# EAGLE schematic Promobot revA (EAGLE 6.5.0)

## Sheet 1 of 10: M1 driver with CS
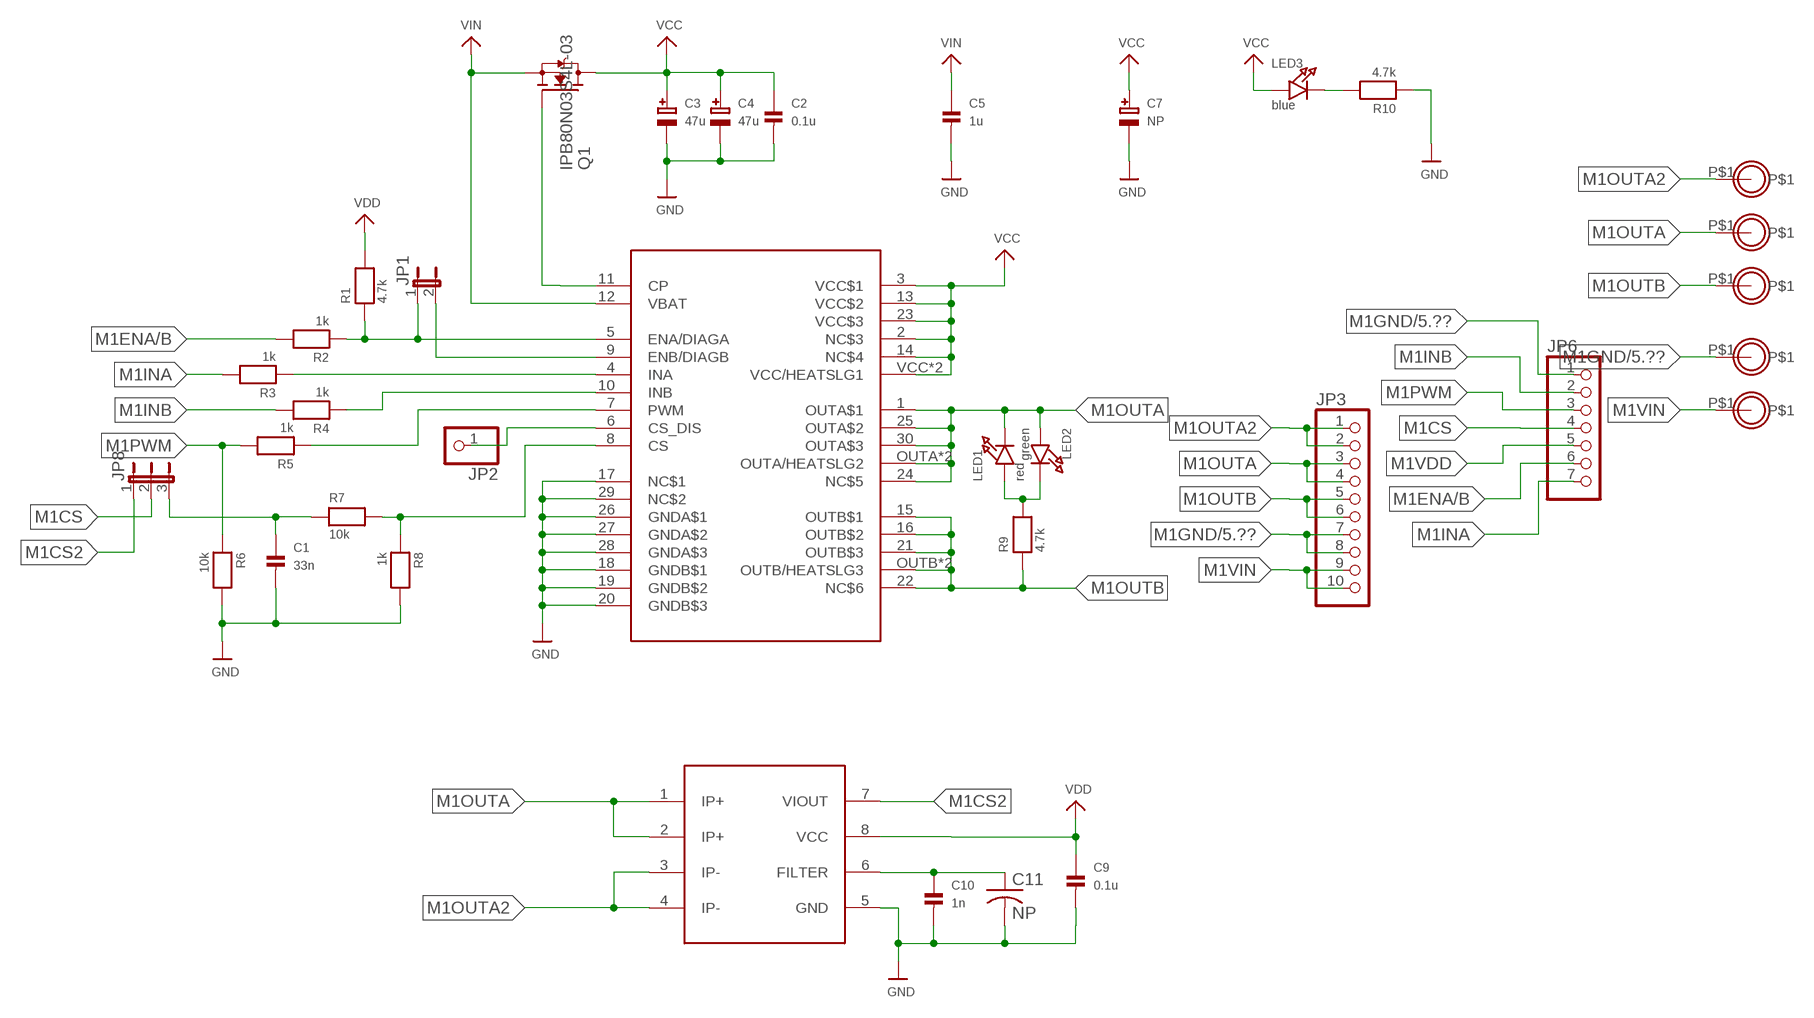
[diagram p0: schematic, sheet 1]

### Parts
C1  33n  CAP_CERAMIC_0603  [_0603]
C2  0.1u  CAP_CERAMIC_0603  [_0603]
C3  47u  CAP_ELECTROLYTICPANASONIC_C  [PANASONIC_C]
C4  47u  CAP_ELECTROLYTICPANASONIC_C  [PANASONIC_C]
C5  1u  CAP_CERAMIC_0805  [_0805]
C7  NP  CAP_ELECTROLYTICPTH_3.5MMGRID_10MMDIA  [CELEC_3.5MM_10MM]
C9  0.1u  CAP_CERAMIC_0603  [_0603]
C10  1n  CAP_CERAMIC_0603  [_0603]
C11  NP  C-US025-024X044  [C025-024X044]
JP1  JUMPER2  [JUMPER2]
JP2  HEADER-1X1ROUND  [1X01_ROUND]
JP3  HEADER-1X10ROUND  [1X10_ROUND]
JP6  HEADER-1X7ROUND  [1X07_ROUND]
JP8  JUMPER3  [JUMPER3]
LED1  red  LED0603  [CHIPLED_0603]
LED2  green  LED0603  [CHIPLED_0603]
LED3  blue  LED0603  [CHIPLED_0603]
M1OUTA  MOUNTINGHOLE2.5_THICK  [MOUNTINGHOLE_2.5_PLATED_THICK]
M1OUTA1  MOUNTINGHOLE2.5_THICK  [MOUNTINGHOLE_2.5_PLATED_THICK]
M1OUTA3  MOUNTINGHOLE2.5_THICK  [MOUNTINGHOLE_2.5_PLATED_THICK]
M1OUTA4  MOUNTINGHOLE2.5_THICK  [MOUNTINGHOLE_2.5_PLATED_THICK]
M1OUTB  MOUNTINGHOLE2.5_THICK  [MOUNTINGHOLE_2.5_PLATED_THICK]
Q1  IPB80N03S4L-03  [TO263]
R1  4.7k  RESISTOR0603  [0603]
R2  1k  RESISTOR0603  [0603]
R3  1k  RESISTOR0603  [0603]
R4  1k  RESISTOR0603  [0603]
R5  1k  RESISTOR0603  [0603]
R6  10k  RESISTOR0603  [0603]
R7  10k  RESISTOR0603  [0603]
R8  1k  RESISTOR0603  [0603]
R9  4.7k  RESISTOR0603  [0603]
R10  4.7k  RESISTOR0603  [0603]
U1  VNH5019A-E  [MULTIPOWERSO-30]
U2  ACS714  [SOIC8_208MIL]

### Nets
M1CS: JP6.4 JP8.2
M1CS1: C1.1 JP8.3 R7.1
M1CS2: JP8.1 U2.7(VIOUT)
M1ENA/B: JP6.6 R2.2
M1GND: C1.2 C2.2 C3.- C4.- C5.2 C7.- C9.2 C10.2 C11.2 JP3.7 JP3.8 JP6.1 M1OUTA3.P$1 R6.2 R8.2 R10.1 U1.17(NC$1) U1.18(GNDB$1) U1.19(GNDB$2) U1.20(GNDB$3) U1.26(GNDA$1) U1.27(GNDA$2) U1.28(GNDA$3) U1.29(NC$2) U2.5(GND) ; supply symbol labelled GND ; also sheet 5
M1INA: JP6.7 R3.2
M1INB: JP6.2 R4.2
M1OUTA: JP3.3 JP3.4 LED1.C LED2.A M1OUTA1.P$1 U1.1(OUTA$1) U1.24(NC$5) U1.25(OUTA$2) U1.30(OUTA$3) U1.OUTA(OUTA/HEATSLG2) U1.OUTA@1(OUTA/HEATSLG2) U2.1(IP+) U2.2(IP+)
M1OUTA2: JP3.1 JP3.2 M1OUTA.P$1 U2.3(IP-) U2.4(IP-)
M1OUTB: JP3.5 JP3.6 M1OUTB.P$1 R9.1 U1.15(OUTB$1) U1.16(OUTB$2) U1.21(OUTB$3) U1.22(NC$6) U1.OUTB(OUTB/HEATSLG3) U1.OUTB@1(OUTB/HEATSLG3)
M1PWM: JP6.3 R5.2 R6.1
M1VCC: C2.1 C3.+ C4.+ C7.+ LED3.A Q1.3(D) U1.2(NC$3) U1.3(VCC$1) U1.13(VCC$2) U1.14(NC$4) U1.23(VCC$3) U1.VCC(VCC/HEATSLG1) U1.VCC@1(VCC/HEATSLG1) ; supply symbol labelled VCC ; also sheet 5
M1VDD: C9.1 JP6.5 R1.2 U2.8(VCC) ; supply symbol labelled VDD
M1VIN: C5.1 JP3.9 JP3.10 M1OUTA4.P$1 Q1.2(S) U1.12(VBAT) ; supply symbol labelled VIN
N$1: Q1.1(G) U1.11(CP)
N$2: JP1.2 U1.9(ENB/DIAGB)
N$3: R5.1 U1.7(PWM)
N$4: JP1.1 R1.1 R2.1 U1.5(ENA/DIAGA)
N$5: R7.2 R8.1 U1.8(CS)
N$6: R3.1 U1.4(INA)
N$7: R4.1 U1.10(INB)
N$8: JP2.1 U1.6(CS_DIS)
N$9: LED3.C R10.2
N$10: C10.1 C11.1 U2.6(FILTER)
N$11: LED1.A LED2.C R9.2

## Sheet 2 of 10: M2 driver with CS
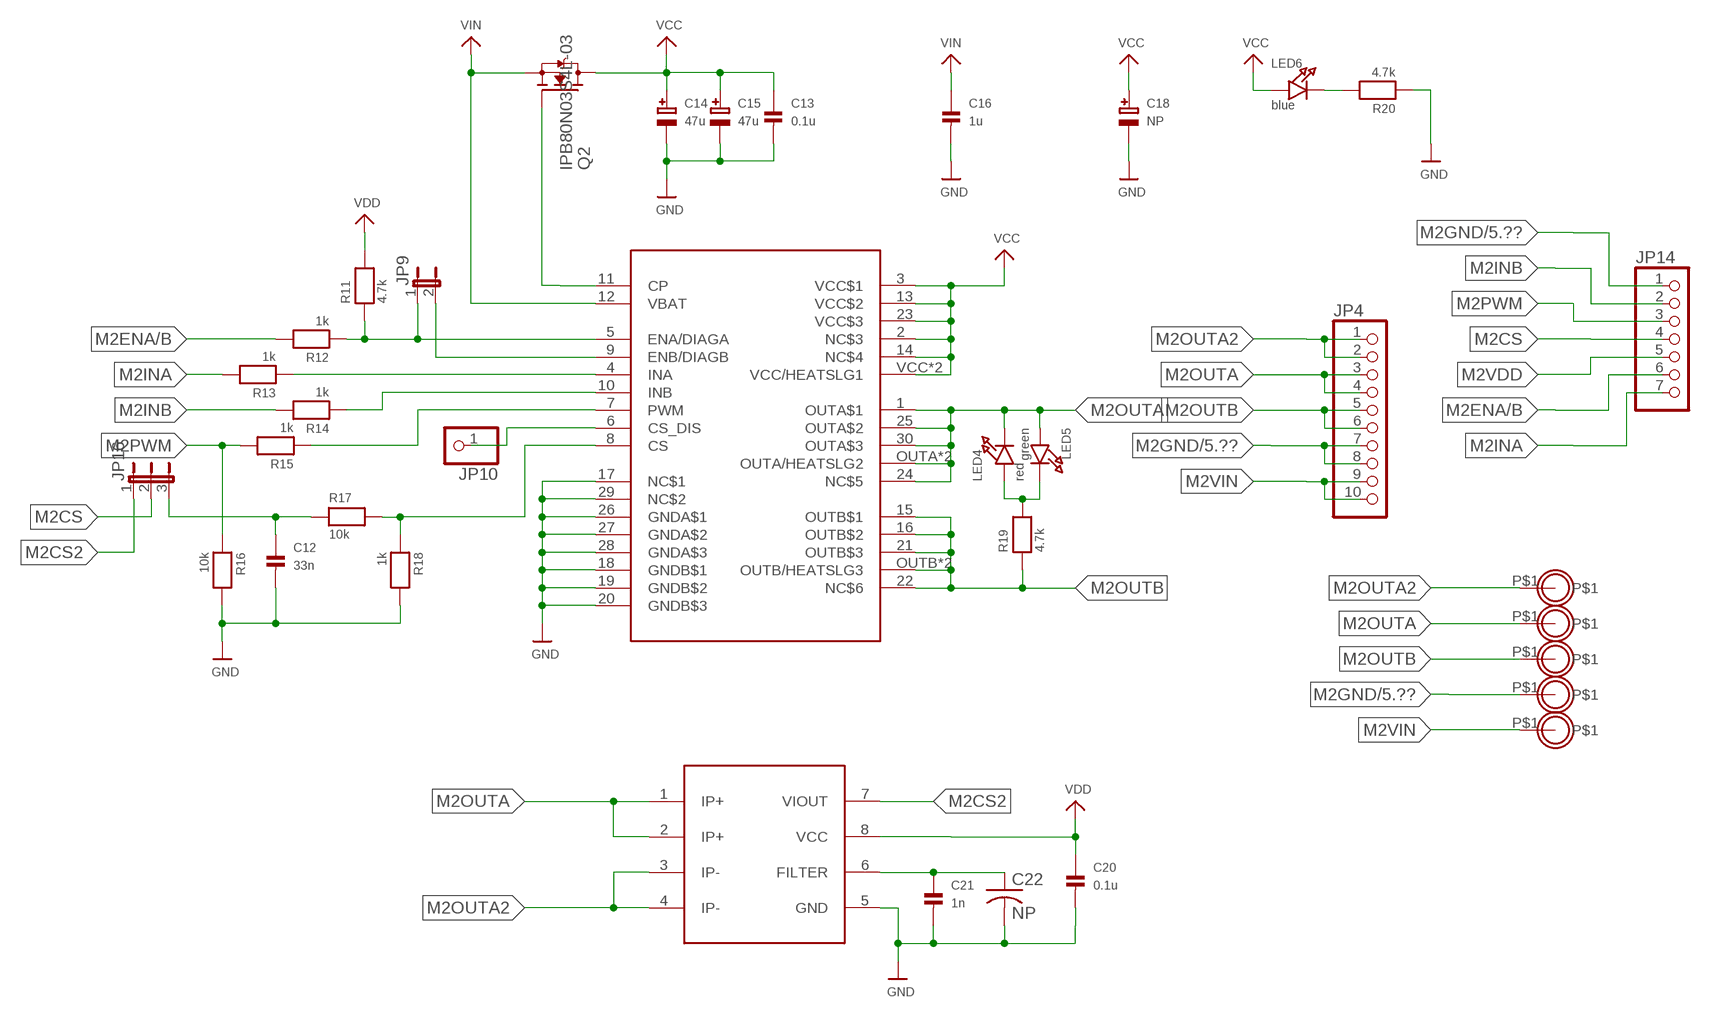
[diagram p1: schematic, sheet 2]

### Parts
C12  33n  CAP_CERAMIC_0603  [_0603]
C13  0.1u  CAP_CERAMIC_0603  [_0603]
C14  47u  CAP_ELECTROLYTICPANASONIC_C  [PANASONIC_C]
C15  47u  CAP_ELECTROLYTICPANASONIC_C  [PANASONIC_C]
C16  1u  CAP_CERAMIC_0805  [_0805]
C18  NP  CAP_ELECTROLYTICPTH_3.5MMGRID_10MMDIA  [CELEC_3.5MM_10MM]
C20  0.1u  CAP_CERAMIC_0603  [_0603]
C21  1n  CAP_CERAMIC_0603  [_0603]
C22  NP  C-US025-024X044  [C025-024X044]
JP4  HEADER-1X10ROUND  [1X10_ROUND]
JP9  JUMPER2  [JUMPER2]
JP10  HEADER-1X1ROUND  [1X01_ROUND]
JP14  HEADER-1X7ROUND  [1X07_ROUND]
JP16  JUMPER3  [JUMPER3]
LED4  red  LED0603  [CHIPLED_0603]
LED5  green  LED0603  [CHIPLED_0603]
LED6  blue  LED0603  [CHIPLED_0603]
M1OUTA2  MOUNTINGHOLE2.5_THICK  [MOUNTINGHOLE_2.5_PLATED_THICK]
M1OUTA5  MOUNTINGHOLE2.5_THICK  [MOUNTINGHOLE_2.5_PLATED_THICK]
M1OUTA6  MOUNTINGHOLE2.5_THICK  [MOUNTINGHOLE_2.5_PLATED_THICK]
M1OUTA7  MOUNTINGHOLE2.5_THICK  [MOUNTINGHOLE_2.5_PLATED_THICK]
M1OUTB1  MOUNTINGHOLE2.5_THICK  [MOUNTINGHOLE_2.5_PLATED_THICK]
Q2  IPB80N03S4L-03  [TO263]
R11  4.7k  RESISTOR0603  [0603]
R12  1k  RESISTOR0603  [0603]
R13  1k  RESISTOR0603  [0603]
R14  1k  RESISTOR0603  [0603]
R15  1k  RESISTOR0603  [0603]
R16  10k  RESISTOR0603  [0603]
R17  10k  RESISTOR0603  [0603]
R18  1k  RESISTOR0603  [0603]
R19  4.7k  RESISTOR0603  [0603]
R20  4.7k  RESISTOR0603  [0603]
U3  VNH5019A-E  [MULTIPOWERSO-30]
U4  ACS714  [SOIC8_208MIL]

### Nets
M2CS: JP14.4 JP16.2
M2CS2: JP16.1 U4.7(VIOUT)
M2ENA/B: JP14.6 R12.2
M2GND: C12.2 C13.2 C14.- C15.- C16.2 C18.- C20.2 C21.2 C22.2 JP4.7 JP4.8 JP14.1 M1OUTA6.P$1 R16.2 R18.2 R20.1 U3.17(NC$1) U3.18(GNDB$1) U3.19(GNDB$2) U3.20(GNDB$3) U3.26(GNDA$1) U3.27(GNDA$2) U3.28(GNDA$3) U3.29(NC$2) U4.5(GND) ; supply symbol labelled GND ; also sheet 5
M2INA: JP14.7 R13.2
M2INB: JP14.2 R14.2
M2OUTA: JP4.3 JP4.4 LED4.C LED5.A M1OUTA5.P$1 U3.1(OUTA$1) U3.24(NC$5) U3.25(OUTA$2) U3.30(OUTA$3) U3.OUTA(OUTA/HEATSLG2) U3.OUTA@1(OUTA/HEATSLG2) U4.1(IP+) U4.2(IP+)
M2OUTA2: JP4.1 JP4.2 M1OUTA2.P$1 U4.3(IP-) U4.4(IP-)
M2OUTB: JP4.5 JP4.6 M1OUTB1.P$1 R19.1 U3.15(OUTB$1) U3.16(OUTB$2) U3.21(OUTB$3) U3.22(NC$6) U3.OUTB(OUTB/HEATSLG3) U3.OUTB@1(OUTB/HEATSLG3)
M2PWM: JP14.3 R15.2 R16.1
M2VCC: C13.1 C14.+ C15.+ C18.+ LED6.A Q2.3(D) U3.2(NC$3) U3.3(VCC$1) U3.13(VCC$2) U3.14(NC$4) U3.23(VCC$3) U3.VCC(VCC/HEATSLG1) U3.VCC@1(VCC/HEATSLG1) ; supply symbol labelled VCC ; also sheet 5
M2VDD: C20.1 JP14.5 R11.2 U4.8(VCC) ; supply symbol labelled VDD
M2VIN: C16.1 JP4.9 JP4.10 M1OUTA7.P$1 Q2.2(S) U3.12(VBAT) ; supply symbol labelled VIN
N$13: Q2.1(G) U3.11(CP)
N$14: JP9.1 R11.1 R12.1 U3.5(ENA/DIAGA)
N$15: JP9.2 U3.9(ENB/DIAGB)
N$16: R13.1 U3.4(INA)
N$17: R14.1 U3.10(INB)
N$18: R15.1 U3.7(PWM)
N$19: R17.2 R18.1 U3.8(CS)
N$20: JP10.1 U3.6(CS_DIS)
N$21: LED4.A LED5.C R19.2
N$22: LED6.C R20.2
N$23: C21.1 C22.1 U4.6(FILTER)
N$24: C12.1 JP16.3 R17.1

## Sheet 3 of 10: M3 driver with CS
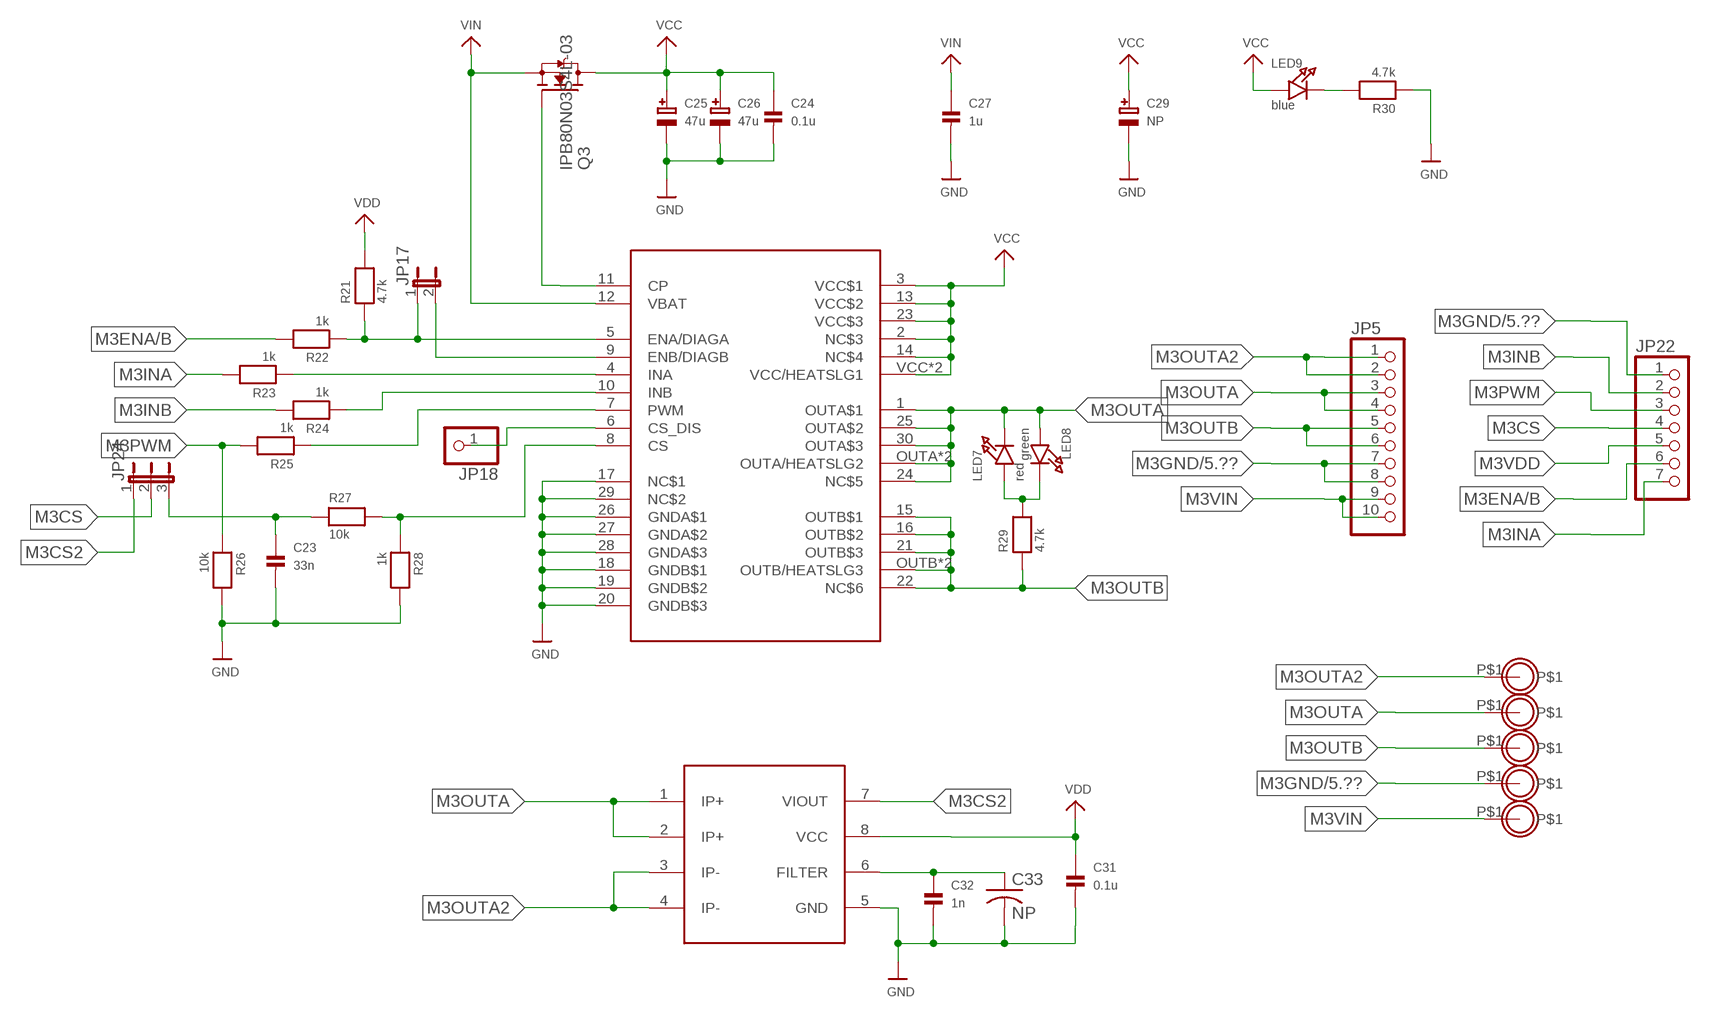
[diagram p2: schematic, sheet 3]

### Parts
C23  33n  CAP_CERAMIC_0603  [_0603]
C24  0.1u  CAP_CERAMIC_0603  [_0603]
C25  47u  CAP_ELECTROLYTICPANASONIC_C  [PANASONIC_C]
C26  47u  CAP_ELECTROLYTICPANASONIC_C  [PANASONIC_C]
C27  1u  CAP_CERAMIC_0805  [_0805]
C29  NP  CAP_ELECTROLYTICPTH_3.5MMGRID_10MMDIA  [CELEC_3.5MM_10MM]
C31  0.1u  CAP_CERAMIC_0603  [_0603]
C32  1n  CAP_CERAMIC_0603  [_0603]
C33  NP  C-US025-024X044  [C025-024X044]
JP5  HEADER-1X10ROUND  [1X10_ROUND]
JP17  JUMPER2  [JUMPER2]
JP18  HEADER-1X1ROUND  [1X01_ROUND]
JP22  HEADER-1X7ROUND  [1X07_ROUND]
JP24  JUMPER3  [JUMPER3]
LED7  red  LED0603  [CHIPLED_0603]
LED8  green  LED0603  [CHIPLED_0603]
LED9  blue  LED0603  [CHIPLED_0603]
M1OUTA8  MOUNTINGHOLE2.5_THICK  [MOUNTINGHOLE_2.5_PLATED_THICK]
M1OUTA9  MOUNTINGHOLE2.5_THICK  [MOUNTINGHOLE_2.5_PLATED_THICK]
M1OUTA10  MOUNTINGHOLE2.5_THICK  [MOUNTINGHOLE_2.5_PLATED_THICK]
M1OUTA11  MOUNTINGHOLE2.5_THICK  [MOUNTINGHOLE_2.5_PLATED_THICK]
M1OUTB2  MOUNTINGHOLE2.5_THICK  [MOUNTINGHOLE_2.5_PLATED_THICK]
Q3  IPB80N03S4L-03  [TO263]
R21  4.7k  RESISTOR0603  [0603]
R22  1k  RESISTOR0603  [0603]
R23  1k  RESISTOR0603  [0603]
R24  1k  RESISTOR0603  [0603]
R25  1k  RESISTOR0603  [0603]
R26  10k  RESISTOR0603  [0603]
R27  10k  RESISTOR0603  [0603]
R28  1k  RESISTOR0603  [0603]
R29  4.7k  RESISTOR0603  [0603]
R30  4.7k  RESISTOR0603  [0603]
U5  VNH5019A-E  [MULTIPOWERSO-30]
U6  ACS714  [SOIC8_208MIL]

### Nets
M3CS: JP22.4 JP24.2
M3CS2: JP24.1 U6.7(VIOUT)
M3ENA/B: JP22.6 R22.2
M3GND: C23.2 C24.2 C25.- C26.- C27.2 C29.- C31.2 C32.2 C33.2 JP5.7 JP5.8 JP22.1 M1OUTA10.P$1 R26.2 R28.2 R30.1 U5.17(NC$1) U5.18(GNDB$1) U5.19(GNDB$2) U5.20(GNDB$3) U5.26(GNDA$1) U5.27(GNDA$2) U5.28(GNDA$3) U5.29(NC$2) U6.5(GND) ; supply symbol labelled GND ; also sheet 5
M3INA: JP22.7 R23.2
M3INB: JP22.2 R24.2
M3OUTA: JP5.3 JP5.4 LED7.C LED8.A M1OUTA9.P$1 U5.1(OUTA$1) U5.24(NC$5) U5.25(OUTA$2) U5.30(OUTA$3) U5.OUTA(OUTA/HEATSLG2) U5.OUTA@1(OUTA/HEATSLG2) U6.1(IP+) U6.2(IP+)
M3OUTA2: JP5.1 JP5.2 M1OUTA8.P$1 U6.3(IP-) U6.4(IP-)
M3OUTB: JP5.5 JP5.6 M1OUTB2.P$1 R29.1 U5.15(OUTB$1) U5.16(OUTB$2) U5.21(OUTB$3) U5.22(NC$6) U5.OUTB(OUTB/HEATSLG3) U5.OUTB@1(OUTB/HEATSLG3)
M3PWM: JP22.3 R25.2 R26.1
M3VCC: C24.1 C25.+ C26.+ C29.+ LED9.A Q3.3(D) U5.2(NC$3) U5.3(VCC$1) U5.13(VCC$2) U5.14(NC$4) U5.23(VCC$3) U5.VCC(VCC/HEATSLG1) U5.VCC@1(VCC/HEATSLG1) ; supply symbol labelled VCC ; also sheet 5
M3VDD: C31.1 JP22.5 R21.2 U6.8(VCC) ; supply symbol labelled VDD
M3VIN: C27.1 JP5.9 JP5.10 M1OUTA11.P$1 Q3.2(S) U5.12(VBAT) ; supply symbol labelled VIN
N$25: Q3.1(G) U5.11(CP)
N$26: JP17.1 R21.1 R22.1 U5.5(ENA/DIAGA)
N$27: JP17.2 U5.9(ENB/DIAGB)
N$28: R23.1 U5.4(INA)
N$29: R24.1 U5.10(INB)
N$30: R25.1 U5.7(PWM)
N$31: R27.2 R28.1 U5.8(CS)
N$32: JP18.1 U5.6(CS_DIS)
N$33: LED7.A LED8.C R29.2
N$34: LED9.C R30.2
N$35: C32.1 C33.1 U6.6(FILTER)
N$48: C23.1 JP24.3 R27.1

## Sheet 4 of 10: M4 driver with CS
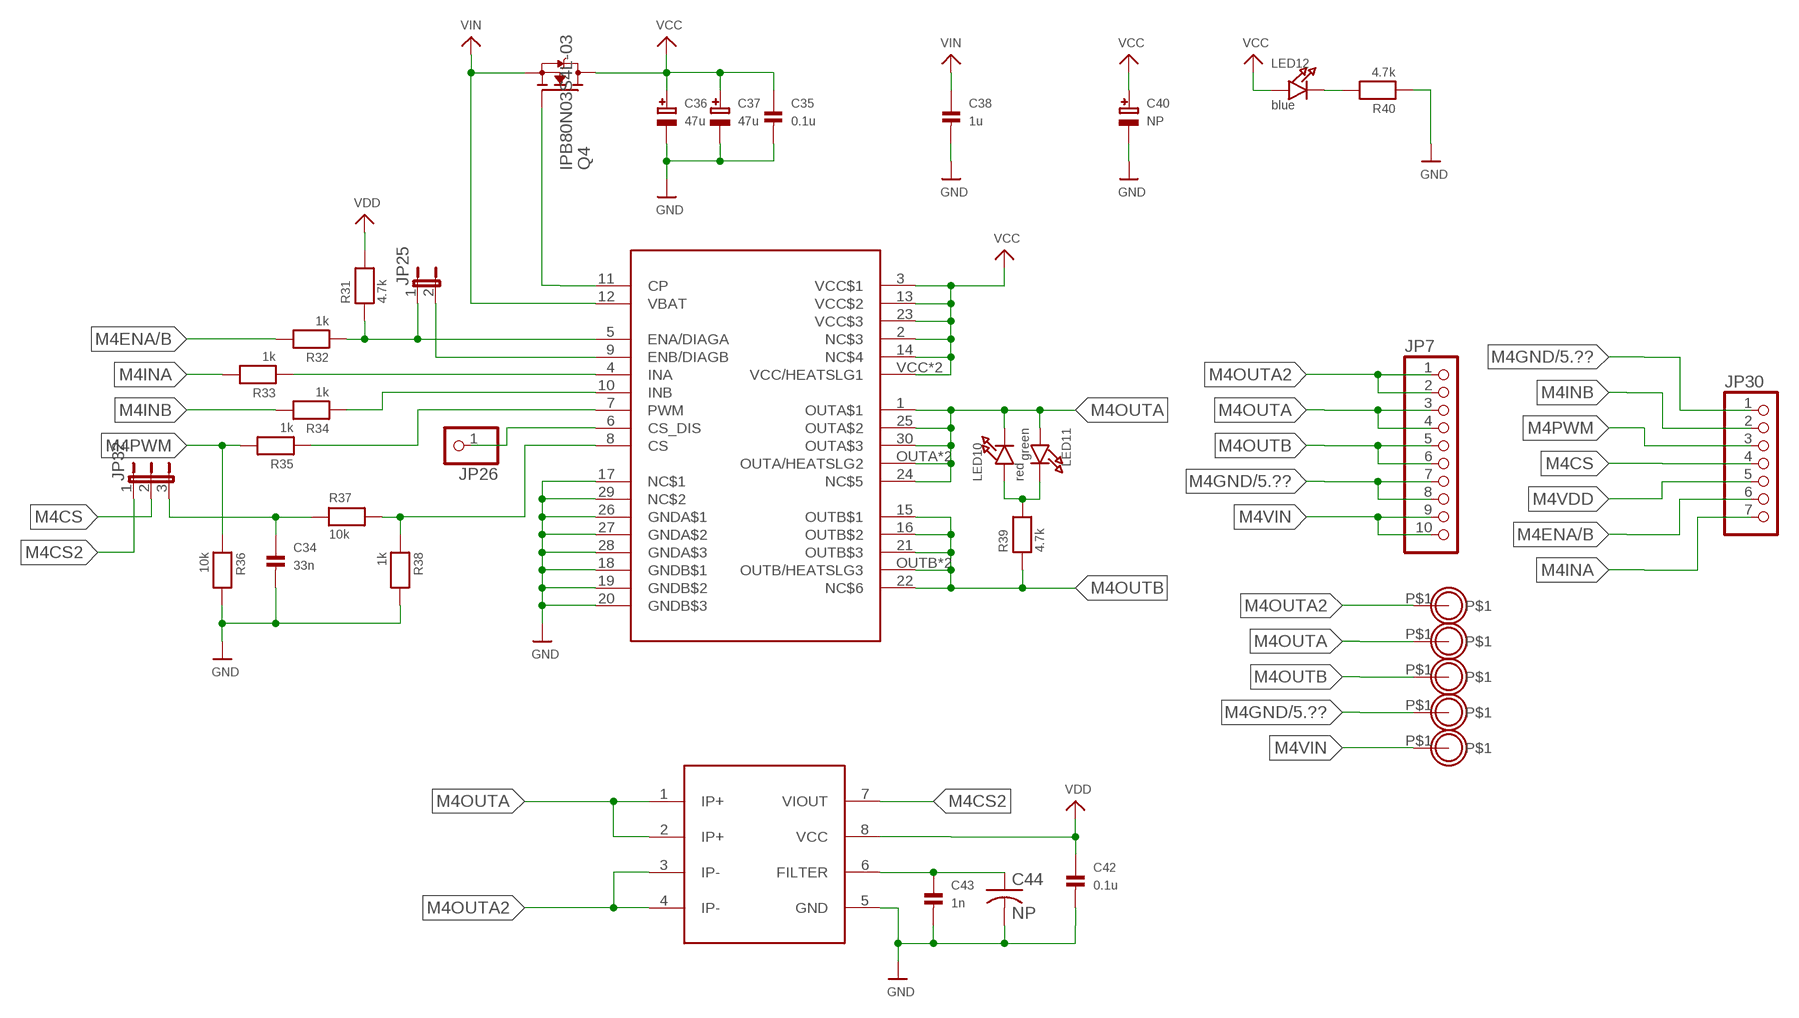
[diagram p3: schematic, sheet 4]

### Parts
C34  33n  CAP_CERAMIC_0603  [_0603]
C35  0.1u  CAP_CERAMIC_0603  [_0603]
C36  47u  CAP_ELECTROLYTICPANASONIC_C  [PANASONIC_C]
C37  47u  CAP_ELECTROLYTICPANASONIC_C  [PANASONIC_C]
C38  1u  CAP_CERAMIC_0805  [_0805]
C40  NP  CAP_ELECTROLYTICPTH_3.5MMGRID_10MMDIA  [CELEC_3.5MM_10MM]
C42  0.1u  CAP_CERAMIC_0603  [_0603]
C43  1n  CAP_CERAMIC_0603  [_0603]
C44  NP  C-US025-024X044  [C025-024X044]
JP7  HEADER-1X10ROUND  [1X10_ROUND]
JP25  JUMPER2  [JUMPER2]
JP26  HEADER-1X1ROUND  [1X01_ROUND]
JP30  HEADER-1X7ROUND  [1X07_ROUND]
JP32  JUMPER3  [JUMPER3]
LED10  red  LED0603  [CHIPLED_0603]
LED11  green  LED0603  [CHIPLED_0603]
LED12  blue  LED0603  [CHIPLED_0603]
M1OUTA12  MOUNTINGHOLE2.5_THICK  [MOUNTINGHOLE_2.5_PLATED_THICK]
M1OUTA13  MOUNTINGHOLE2.5_THICK  [MOUNTINGHOLE_2.5_PLATED_THICK]
M1OUTA14  MOUNTINGHOLE2.5_THICK  [MOUNTINGHOLE_2.5_PLATED_THICK]
M1OUTA15  MOUNTINGHOLE2.5_THICK  [MOUNTINGHOLE_2.5_PLATED_THICK]
M1OUTB3  MOUNTINGHOLE2.5_THICK  [MOUNTINGHOLE_2.5_PLATED_THICK]
Q4  IPB80N03S4L-03  [TO263]
R31  4.7k  RESISTOR0603  [0603]
R32  1k  RESISTOR0603  [0603]
R33  1k  RESISTOR0603  [0603]
R34  1k  RESISTOR0603  [0603]
R35  1k  RESISTOR0603  [0603]
R36  10k  RESISTOR0603  [0603]
R37  10k  RESISTOR0603  [0603]
R38  1k  RESISTOR0603  [0603]
R39  4.7k  RESISTOR0603  [0603]
R40  4.7k  RESISTOR0603  [0603]
U7  VNH5019A-E  [MULTIPOWERSO-30]
U8  ACS714  [SOIC8_208MIL]

### Nets
M4CS: JP30.4 JP32.2
M4CS2: JP32.1 U8.7(VIOUT)
M4ENA/B: JP30.6 R32.2
M4GND: C34.2 C35.2 C36.- C37.- C38.2 C40.- C42.2 C43.2 C44.2 JP7.7 JP7.8 JP30.1 M1OUTA14.P$1 R36.2 R38.2 R40.1 U7.17(NC$1) U7.18(GNDB$1) U7.19(GNDB$2) U7.20(GNDB$3) U7.26(GNDA$1) U7.27(GNDA$2) U7.28(GNDA$3) U7.29(NC$2) U8.5(GND) ; supply symbol labelled GND ; also sheet 5
M4INA: JP30.7 R33.2
M4INB: JP30.2 R34.2
M4OUTA: JP7.3 JP7.4 LED10.C LED11.A M1OUTA13.P$1 U7.1(OUTA$1) U7.24(NC$5) U7.25(OUTA$2) U7.30(OUTA$3) U7.OUTA(OUTA/HEATSLG2) U7.OUTA@1(OUTA/HEATSLG2) U8.1(IP+) U8.2(IP+)
M4OUTA2: JP7.1 JP7.2 M1OUTA12.P$1 U8.3(IP-) U8.4(IP-)
M4OUTB: JP7.5 JP7.6 M1OUTB3.P$1 R39.1 U7.15(OUTB$1) U7.16(OUTB$2) U7.21(OUTB$3) U7.22(NC$6) U7.OUTB(OUTB/HEATSLG3) U7.OUTB@1(OUTB/HEATSLG3)
M4PWM: JP30.3 R35.2 R36.1
M4VCC: C35.1 C36.+ C37.+ C40.+ LED12.A Q4.3(D) U7.2(NC$3) U7.3(VCC$1) U7.13(VCC$2) U7.14(NC$4) U7.23(VCC$3) U7.VCC(VCC/HEATSLG1) U7.VCC@1(VCC/HEATSLG1) ; supply symbol labelled VCC ; also sheet 5
M4VDD: C42.1 JP30.5 R31.2 U8.8(VCC) ; supply symbol labelled VDD
M4VIN: C38.1 JP7.9 JP7.10 M1OUTA15.P$1 Q4.2(S) U7.12(VBAT) ; supply symbol labelled VIN
N$37: Q4.1(G) U7.11(CP)
N$38: JP25.1 R31.1 R32.1 U7.5(ENA/DIAGA)
N$39: JP25.2 U7.9(ENB/DIAGB)
N$40: R33.1 U7.4(INA)
N$41: R34.1 U7.10(INB)
N$42: R35.1 U7.7(PWM)
N$43: R37.2 R38.1 U7.8(CS)
N$44: JP26.1 U7.6(CS_DIS)
N$45: LED10.A LED11.C R39.2
N$46: LED12.C R40.2
N$47: C43.1 C44.1 U8.6(FILTER)
N$49: C34.1 JP32.3 R37.1

## Sheet 5 of 10: General
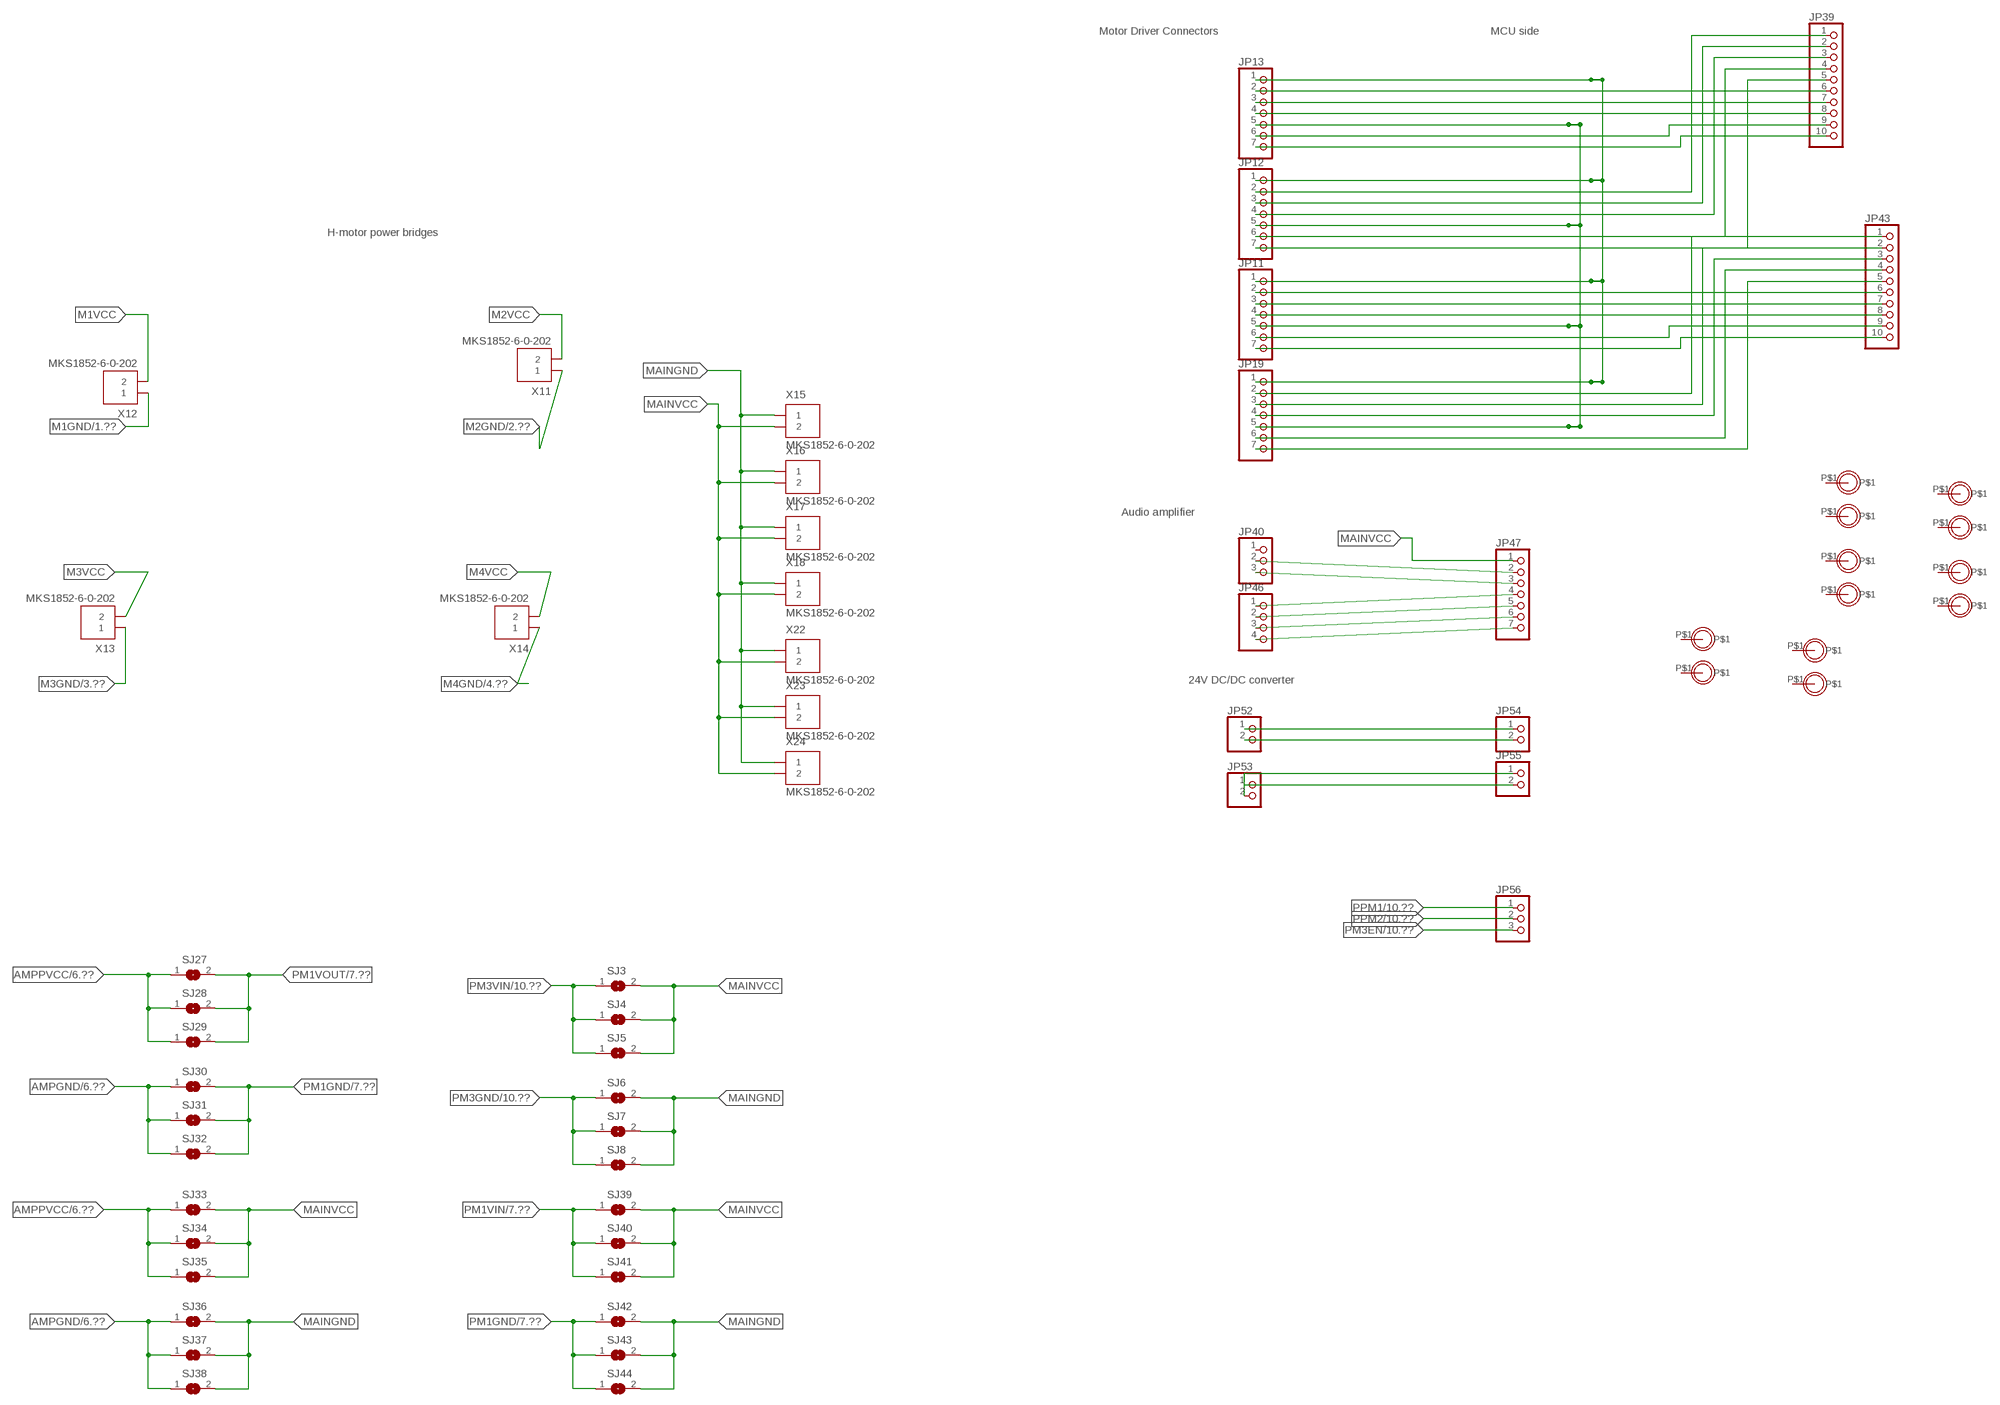
[diagram p4: schematic, sheet 5]

### Parts
JP11  HEADER-1X7ROUND  [1X07_ROUND]
JP12  HEADER-1X7ROUND  [1X07_ROUND]
JP13  HEADER-1X7ROUND  [1X07_ROUND]
JP19  HEADER-1X7ROUND  [1X07_ROUND]
JP39  HEADER-1X1070MIL  [1X10_ROUND70]
JP40  HEADER-1X376MIL  [1X03_ROUND_76]
JP43  HEADER-1X1070MIL  [1X10_ROUND70]
JP46  HEADER-1X476MIL  [1X04_ROUND_76]
JP47  HEADER-1X7ROUND  [1X07_ROUND]
JP52  HEADER-1X2ROUND  [1X02_ROUND]
JP53  HEADER-1X2ROUND  [1X02_ROUND]
JP54  HEADER-1X2ROUND  [1X02_ROUND]
JP55  HEADER-1X2ROUND  [1X02_ROUND]
JP56  HEADER-1X3ROUND  [1X03_ROUND]
M1OUTA16  MOUNTINGHOLE2.5_THICK  [MOUNTINGHOLE_2.5_PLATED_THICK]
M1OUTA17  MOUNTINGHOLE2.5_THICK  [MOUNTINGHOLE_2.5_PLATED_THICK]
M1OUTA18  MOUNTINGHOLE2.5_THICK  [MOUNTINGHOLE_2.5_PLATED_THICK]
M1OUTA19  MOUNTINGHOLE2.5_THICK  [MOUNTINGHOLE_2.5_PLATED_THICK]
M1OUTA20  MOUNTINGHOLE2.5_THICK  [MOUNTINGHOLE_2.5_PLATED_THICK]
M1OUTA21  MOUNTINGHOLE2.5_THICK  [MOUNTINGHOLE_2.5_PLATED_THICK]
M1OUTA22  MOUNTINGHOLE2.5_THICK  [MOUNTINGHOLE_2.5_PLATED_THICK]
M1OUTA23  MOUNTINGHOLE2.5_THICK  [MOUNTINGHOLE_2.5_PLATED_THICK]
M1OUTA24  MOUNTINGHOLE2.5_THICK  [MOUNTINGHOLE_2.5_PLATED_THICK]
M1OUTA25  MOUNTINGHOLE2.5_THICK  [MOUNTINGHOLE_2.5_PLATED_THICK]
M1OUTB4  MOUNTINGHOLE2.5_THICK  [MOUNTINGHOLE_2.5_PLATED_THICK]
M1OUTB5  MOUNTINGHOLE2.5_THICK  [MOUNTINGHOLE_2.5_PLATED_THICK]
SJ3  SOLDERJUMPER  [SOLDERJUMPER_ARROW_NOPASTE]
SJ4  SOLDERJUMPER  [SOLDERJUMPER_ARROW_NOPASTE]
SJ5  SOLDERJUMPER  [SOLDERJUMPER_ARROW_NOPASTE]
SJ6  SOLDERJUMPER  [SOLDERJUMPER_ARROW_NOPASTE]
SJ7  SOLDERJUMPER  [SOLDERJUMPER_ARROW_NOPASTE]
SJ8  SOLDERJUMPER  [SOLDERJUMPER_ARROW_NOPASTE]
SJ27  SOLDERJUMPER  [SOLDERJUMPER_ARROW_NOPASTE]
SJ28  SOLDERJUMPER  [SOLDERJUMPER_ARROW_NOPASTE]
SJ29  SOLDERJUMPER  [SOLDERJUMPER_ARROW_NOPASTE]
SJ30  SOLDERJUMPER  [SOLDERJUMPER_ARROW_NOPASTE]
SJ31  SOLDERJUMPER  [SOLDERJUMPER_ARROW_NOPASTE]
SJ32  SOLDERJUMPER  [SOLDERJUMPER_ARROW_NOPASTE]
SJ33  SOLDERJUMPER  [SOLDERJUMPER_ARROW_NOPASTE]
SJ34  SOLDERJUMPER  [SOLDERJUMPER_ARROW_NOPASTE]
SJ35  SOLDERJUMPER  [SOLDERJUMPER_ARROW_NOPASTE]
SJ36  SOLDERJUMPER  [SOLDERJUMPER_ARROW_NOPASTE]
SJ37  SOLDERJUMPER  [SOLDERJUMPER_ARROW_NOPASTE]
SJ38  SOLDERJUMPER  [SOLDERJUMPER_ARROW_NOPASTE]
SJ39  SOLDERJUMPER  [SOLDERJUMPER_ARROW_NOPASTE]
SJ40  SOLDERJUMPER  [SOLDERJUMPER_ARROW_NOPASTE]
SJ41  SOLDERJUMPER  [SOLDERJUMPER_ARROW_NOPASTE]
SJ42  SOLDERJUMPER  [SOLDERJUMPER_ARROW_NOPASTE]
SJ43  SOLDERJUMPER  [SOLDERJUMPER_ARROW_NOPASTE]
SJ44  SOLDERJUMPER  [SOLDERJUMPER_ARROW_NOPASTE]
X11  MKS1852-6-0-202  [MKS1852-6-0-202]
X12  MKS1852-6-0-202  [MKS1852-6-0-202]
X13  MKS1852-6-0-202  [MKS1852-6-0-202]
X14  MKS1852-6-0-202  [MKS1852-6-0-202]
X15  MKS1852-6-0-202  [MKS1852-6-0-202]
X16  MKS1852-6-0-202  [MKS1852-6-0-202]
X17  MKS1852-6-0-202  [MKS1852-6-0-202]
X18  MKS1852-6-0-202  [MKS1852-6-0-202]
X22  MKS1852-6-0-202  [MKS1852-6-0-202]
X23  MKS1852-6-0-202  [MKS1852-6-0-202]
X24  MKS1852-6-0-202  [MKS1852-6-0-202]

### Nets
AMPGND: SJ30.1 SJ31.1 SJ32.1 SJ36.1 SJ37.1 SJ38.1 ; also sheet 6
AMPPVCC: SJ27.1 SJ28.1 SJ29.1 SJ33.1 SJ34.1 SJ35.1 ; also sheet 6
M1GND: X12.1 ; also sheet 1
M1VCC: X12.2 ; also sheet 1
M2GND: X11.1 ; also sheet 2
M2VCC: X11.2 ; also sheet 2
M3GND: X13.1 ; also sheet 3
M3VCC: X13.2 ; also sheet 3
M4GND: X14.1 ; also sheet 4
M4VCC: X14.2 ; also sheet 4
MAINGND: JP11.1 JP12.1 JP13.1 JP19.1 SJ6.2 SJ7.2 SJ8.2 SJ36.2 SJ37.2 SJ38.2 SJ42.2 SJ43.2 SJ44.2 X15.1 X16.1 X17.1 X18.1 X22.1 X23.1 X24.1
MAINVCC: JP11.5 JP12.5 JP13.5 JP19.5 JP47.1 SJ3.2 SJ4.2 SJ5.2 SJ33.2 SJ34.2 SJ35.2 SJ39.2 SJ40.2 SJ41.2 X15.2 X16.2 X17.2 X18.2 X22.2 X23.2 X24.2
N$84: JP52.1 JP54.1
N$95: JP52.2 JP54.2
N$100: JP13.2 JP39.6
N$108: JP13.3 JP39.7
N$110: JP13.4 JP39.8
N$113: JP40.2 JP47.2
N$114: JP13.6 JP39.9
N$115: JP13.7 JP39.10
N$117: JP12.2 JP39.1
N$122: JP12.3 JP39.2
N$123: JP12.4 JP39.3
N$125: JP12.6 JP39.4
N$126: JP12.7 JP39.5
N$127: JP40.3 JP47.3
N$128: JP11.2 JP43.6
N$129: JP11.3 JP43.7
N$130: JP11.4 JP43.8
N$131: JP46.1 JP47.4
N$132: JP11.6 JP43.9
N$133: JP11.7 JP43.10
N$134: JP46.2 JP47.5
N$135: JP19.2 JP43.1
N$136: JP19.3 JP43.2
N$137: JP19.4 JP43.3
N$138: JP46.3 JP47.6
N$139: JP19.6 JP43.4
N$140: JP19.7 JP43.5
N$141: JP46.4 JP47.7
N$142: JP53.1 JP55.1
N$143: JP53.2 JP55.2
PM1GND: SJ30.2 SJ31.2 SJ32.2 SJ42.1 SJ43.1 SJ44.1 ; also sheet 7
PM1VIN: SJ39.1 SJ40.1 SJ41.1 ; also sheet 7
PM1VOUT: SJ27.2 SJ28.2 SJ29.2 ; also sheet 7
PM3EN: JP56.3 ; also sheet 10
PM3GND: SJ6.1 SJ7.1 SJ8.1 ; also sheet 10
PM3VIN: SJ3.1 SJ4.1 SJ5.1 ; also sheet 10
PPM1: JP56.1 ; also sheet 10
PPM2: JP56.2 ; also sheet 10
Unconnected: JP40.1 M1OUTA16.P$1 M1OUTA17.P$1 M1OUTA18.P$1 M1OUTA19.P$1 M1OUTA20.P$1 M1OUTA21.P$1 M1OUTA22.P$1 M1OUTA23.P$1 M1OUTA24.P$1 M1OUTA25.P$1 M1OUTB4.P$1 M1OUTB5.P$1

### Notes on the sheet
- Motor Driver Connectors | MCU side
- H-motor power bridges
- Audio amplifier
- 24V DC/DC converter

## Sheet 6 of 10: Sound Amplifier
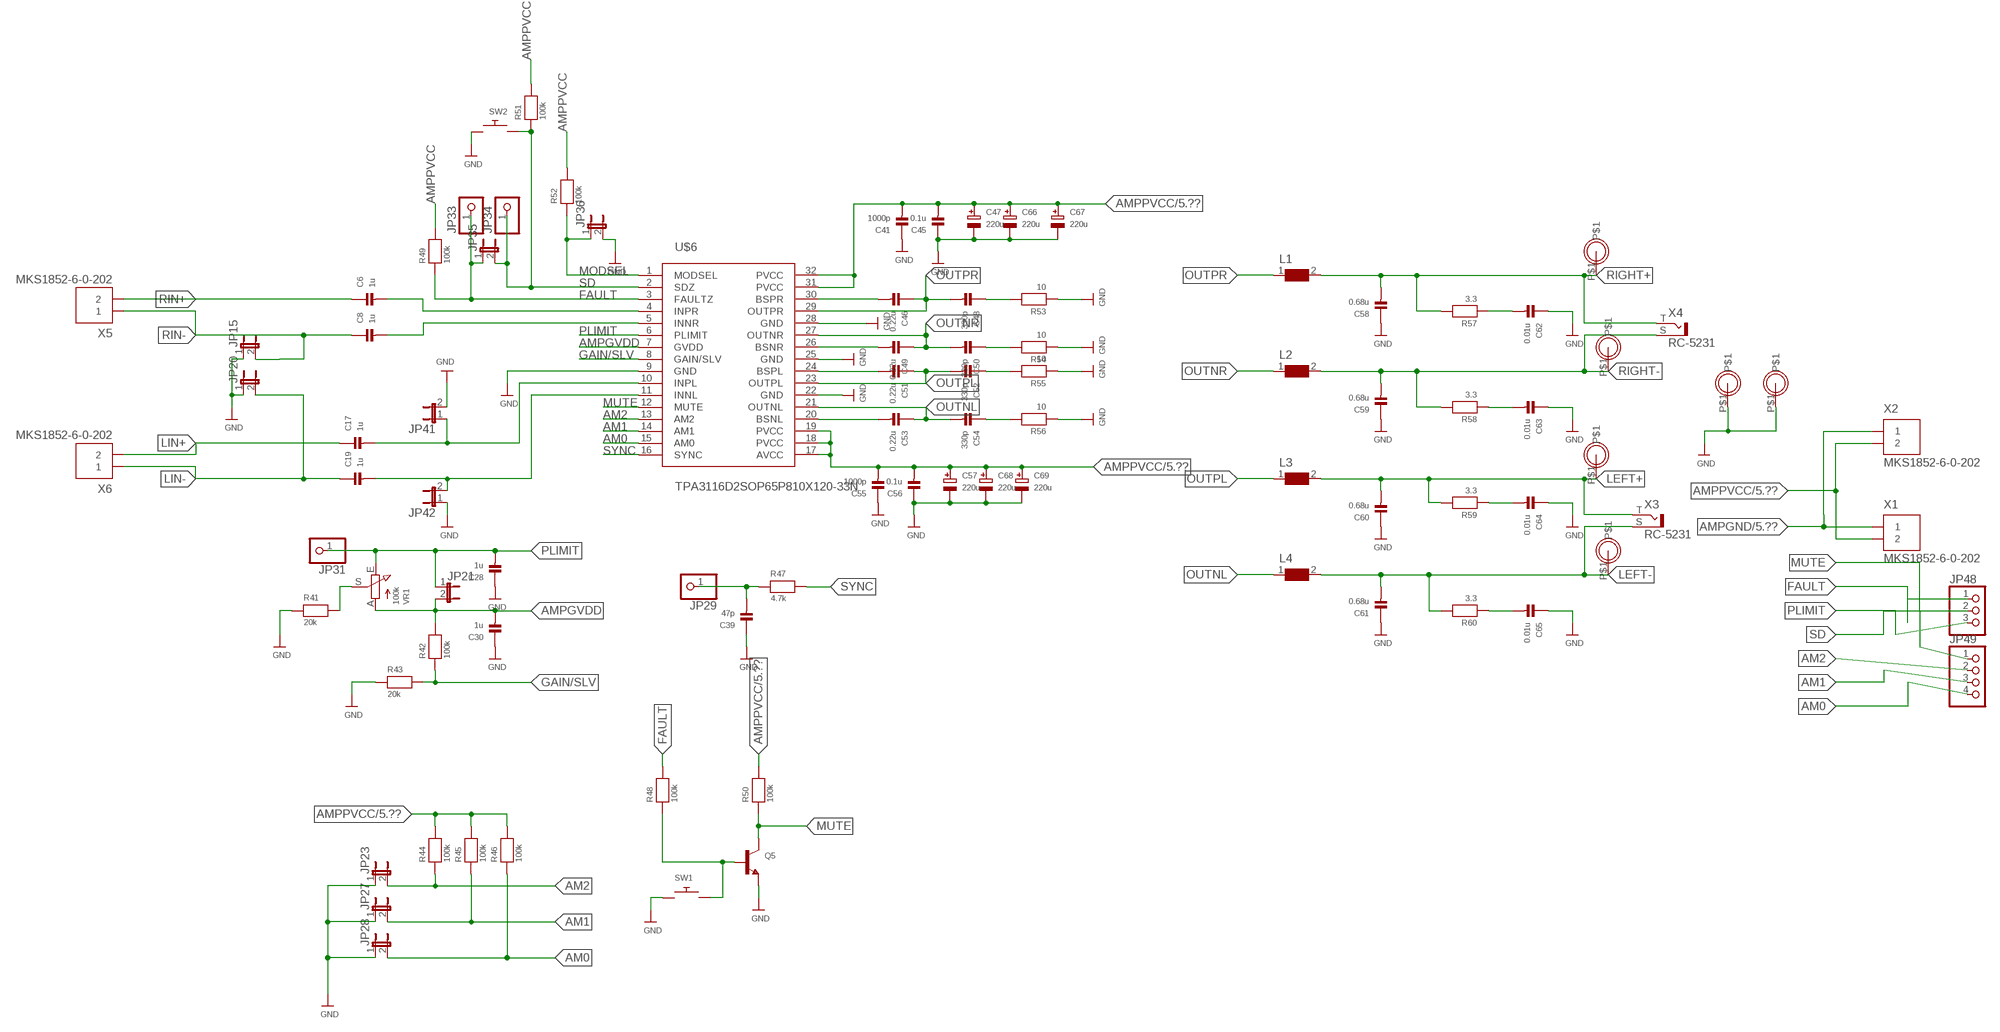
[diagram p5: schematic, sheet 6]

### Parts
C6  1u  CAP_CERAMIC_0603  [_0603]
C8  1u  CAP_CERAMIC_0603  [_0603]
C17  1u  CAP_CERAMIC_0603  [_0603]
C19  1u  CAP_CERAMIC_0603  [_0603]
C28  1u  CAP_CERAMIC_0603MP  [_0603MP]
C30  1u  CAP_CERAMIC_0603MP  [_0603MP]
C39  47p  CAP_CERAMIC_0603  [_0603]
C41  1000p  CAP_CERAMIC_0603  [_0603]
C45  0.1u  CAP_CERAMIC_0603  [_0603]
C46  0.22u  CAP_CERAMIC_0603  [_0603]
C47  220u  CAP_ELECTROLYTICPTH_3.5MMGRID_10MMDIA  [CELEC_3.5MM_10MM]
C48  330p  CAP_CERAMIC_0603  [_0603]
C49  0.22u  CAP_CERAMIC_0603  [_0603]
C50  330p  CAP_CERAMIC_0603  [_0603]
C51  0.22u  CAP_CERAMIC_0603  [_0603]
C52  330p  CAP_CERAMIC_0603  [_0603]
C53  0.22u  CAP_CERAMIC_0603  [_0603]
C54  330p  CAP_CERAMIC_0603  [_0603]
C55  1000p  CAP_CERAMIC_0603  [_0603]
C56  0.1u  CAP_CERAMIC_0603  [_0603]
C57  220u  CAP_ELECTROLYTICPTH_3.5MMGRID_10MMDIA  [CELEC_3.5MM_10MM]
C58  0.68u  CAP_CERAMIC1206  [1206]
C59  0.68u  CAP_CERAMIC1206  [1206]
C60  0.68u  CAP_CERAMIC1206  [1206]
C61  0.68u  CAP_CERAMIC1206  [1206]
C62  0.01u  CAP_CERAMIC_0805  [_0805]
C63  0.01u  CAP_CERAMIC_0805  [_0805]
C64  0.01u  CAP_CERAMIC_0805  [_0805]
C65  0.01u  CAP_CERAMIC_0805  [_0805]
C66  220u  CAP_ELECTROLYTICPTH_3.5MMGRID_10MMDIA  [CELEC_3.5MM_10MM]
C67  220u  CAP_ELECTROLYTICPTH_3.5MMGRID_10MMDIA  [CELEC_3.5MM_10MM]
C68  220u  CAP_ELECTROLYTICPTH_3.5MMGRID_10MMDIA  [CELEC_3.5MM_10MM]
C69  220u  CAP_ELECTROLYTICPTH_3.5MMGRID_10MMDIA  [CELEC_3.5MM_10MM]
JP15  JUMPER2  [JUMPER2]
JP20  JUMPER2  [JUMPER2]
JP21  JUMPER2  [JUMPER2]
JP23  JUMPER2  [JUMPER2]
JP27  JUMPER2  [JUMPER2]
JP28  JUMPER2  [JUMPER2]
JP29  HEADER-1X1ROUND  [1X01_ROUND]
JP31  HEADER-1X1ROUND  [1X01_ROUND]
JP33  HEADER-1X1ROUND  [1X01_ROUND]
JP34  HEADER-1X1ROUND  [1X01_ROUND]
JP35  JUMPER2  [JUMPER2]
JP36  JUMPER2  [JUMPER2]
JP41  JUMPER2  [JUMPER2]
JP42  JUMPER2  [JUMPER2]
JP48  HEADER-1X376MIL  [1X03_ROUND_76]
JP49  HEADER-1X476MIL  [1X04_ROUND_76]
L1  WE-PD-7447709100_1260/1245/1280/1210  [WE-PD_1260/1245/1280/1210]
L2  WE-PD-7447709100_1260/1245/1280/1210  [WE-PD_1260/1245/1280/1210]
L3  WE-PD-7447709100_1260/1245/1280/1210  [WE-PD_1260/1245/1280/1210]
L4  WE-PD-7447709100_1260/1245/1280/1210  [WE-PD_1260/1245/1280/1210]
Q5  TRANSISTOR_NPNWAVE  [SOT23-W]
R41  20k  RESISTOR0603  [0603]
R42  100k  RESISTOR_0805  [_0805]
R43  20k  RESISTOR_0805  [_0805]
R44  100k  RESISTOR0603  [0603]
R45  100k  RESISTOR0603  [0603]
R46  100k  RESISTOR0603  [0603]
R47  4.7k  RESISTOR0603  [0603]
R48  100k  RESISTOR0603  [0603]
R49  100k  RESISTOR0603  [0603]
R50  100k  RESISTOR0603  [0603]
R51  100k  RESISTOR0603  [0603]
R52  100k  RESISTOR0603  [0603]
R53  10  RESISTOR1206  [1206]
R54  10  RESISTOR1206  [1206]
R55  10  RESISTOR1206  [1206]
R56  10  RESISTOR1206  [1206]
R57  3.3  RESISTOR_0603  [_0603]
R58  3.3  RESISTOR_0603  [_0603]
R59  3.3  RESISTOR_0603  [_0603]
R60  3.3  RESISTOR_0603  [_0603]
SW1  SWITCH_PUSHBUTTONSOFTTOUCHSMD_SJ  [PUSHBUTTON_SMD_SJ]
SW2  SWITCH_PUSHBUTTONSOFTTOUCHSMD_SJ  [PUSHBUTTON_SMD_SJ]
U$6  TPA3116D2SOP65P810X120-33N  [SOP65P810X120-33N]
U$81  MOUNTINGHOLE  [MOUNTINGHOLE_3.0_PLATED]
U$82  MOUNTINGHOLE  [MOUNTINGHOLE_3.0_PLATED]
U$83  MOUNTINGHOLE  [MOUNTINGHOLE_3.0_PLATED]
U$84  MOUNTINGHOLE  [MOUNTINGHOLE_3.0_PLATED]
U$89  MOUNTINGHOLE  [MOUNTINGHOLE_3.0_PLATED]
U$90  MOUNTINGHOLE  [MOUNTINGHOLE_3.0_PLATED]
VR1  100k  TRIMPOT10K_BOURNS  [TRIMPOT_BOURNS3MM]
X1  MKS1852-6-0-202  [MKS1852-6-0-202]
X2  MKS1852-6-0-202  [MKS1852-6-0-202]
X3  RC-5231  [RC-5231]
X4  RC-5231  [RC-5231]
X5  MKS1852-6-0-202  [MKS1852-6-0-202]
X6  MKS1852-6-0-202  [MKS1852-6-0-202]

### Nets
AM0: JP28.2 JP49.4 R46.1 U$6.15(AM0)
AM1: JP27.2 JP49.3 R45.1 U$6.14(AM1)
AM2: JP23.2 JP49.2 R44.1 U$6.13(AM2)
AMPGND: C28.1 C30.1 C39.1 C41.1 C45.1 C47.- C55.1 C56.1 C57.- C58.1 C59.1 C60.1 C61.1 C62.1 C63.1 C64.1 C65.1 C66.- C67.- C68.- C69.- JP15.1 JP20.1 JP23.1 JP27.1 JP28.1 JP36.2 JP41.2 JP42.1 Q5.2(E) R41.1 R43.1 R53.1 R54.1 R55.1 R56.1 SW1.P$1 SW2.P$2 U$6.9(GND) U$6.22(GND) U$6.25(GND) U$6.28(GND) U$89.P$1 U$90.P$1 X1.1 X2.1 ; supply symbol labelled GND ; also sheet 5
AMPGVDD: C30.2 JP21.2 R42.2 U$6.7(GVDD) VR1.A
AMPPVCC: C41.2 C45.2 C47.+ C55.2 C56.2 C57.+ C66.+ C67.+ C68.+ C69.+ R44.2 R45.2 R46.2 R49.2 R50.2 R51.2 R52.2 U$6.17(AVCC) U$6.18(PVCC) U$6.19(PVCC) U$6.31(PVCC) U$6.32(PVCC) X1.2 X2.2 ; also sheet 5
FAULT: JP33.1 JP35.1 JP48.1 R48.2 R49.1 U$6.3(FAULTZ)
GAIN/SLV: R42.1 R43.2 U$6.8(GAIN/SLV)
LEFT+: C60.2 L3.2 R59.2 U$83.P$1 X3.T
LEFT-: C61.2 L4.2 R60.2 U$84.P$1 X3.S
LIN+: C17.1 X6.2
LIN-: C19.1 JP20.2 X6.1
MODSEL: JP36.1 R52.1 U$6.1(MODSEL)
MUTE: JP49.1 Q5.3(C) R50.1 U$6.12(MUTE)
N$12: R41.2 VR1.S
N$36: C39.2 JP29.1 R47.1
N$51: Q5.1(B) R48.1 SW1.P$2
N$53: C6.2 U$6.4(INPR)
N$54: C8.2 U$6.5(INNR)
N$55: C46.2 U$6.30(BSPR)
N$56: C48.1 R53.2
N$57: C17.2 JP41.1 U$6.10(INPL)
N$59: C19.2 JP42.2 U$6.11(INNL)
N$65: C51.2 U$6.24(BSPL)
N$66: C49.2 U$6.26(BSNR)
N$68: C50.1 R54.2
N$69: C65.2 R60.1
N$70: C52.1 R55.2
N$71: C62.2 R57.1
N$72: C53.2 U$6.20(BSNL)
N$73: C63.2 R58.1
N$74: C54.1 R56.2
N$76: C64.2 R59.1
OUTNL: C53.1 C54.2 L4.1 U$6.21(OUTNL)
OUTNR: C49.1 C50.2 L2.1 U$6.27(OUTNR)
OUTPL: C51.1 C52.2 L3.1 U$6.23(OUTPL)
OUTPR: C46.1 C48.2 L1.1 U$6.29(OUTPR)
PLIMIT: C28.2 JP21.1 JP31.1 JP48.3 U$6.6(PLIMIT) VR1.E
RIGHT+: C58.2 L1.2 R57.2 U$81.P$1 X4.T
RIGHT-: C59.2 L2.2 R58.2 U$82.P$1 X4.S
RIN+: C6.1 X5.2
RIN-: C8.1 JP15.2 X5.1
SD: JP34.1 JP35.2 JP48.2 R51.1 SW2.P$1 U$6.2(SDZ)
SYNC: R47.2 U$6.16(SYNC)

## Sheet 7 of 10: 21V DC/DC Step-up Converter
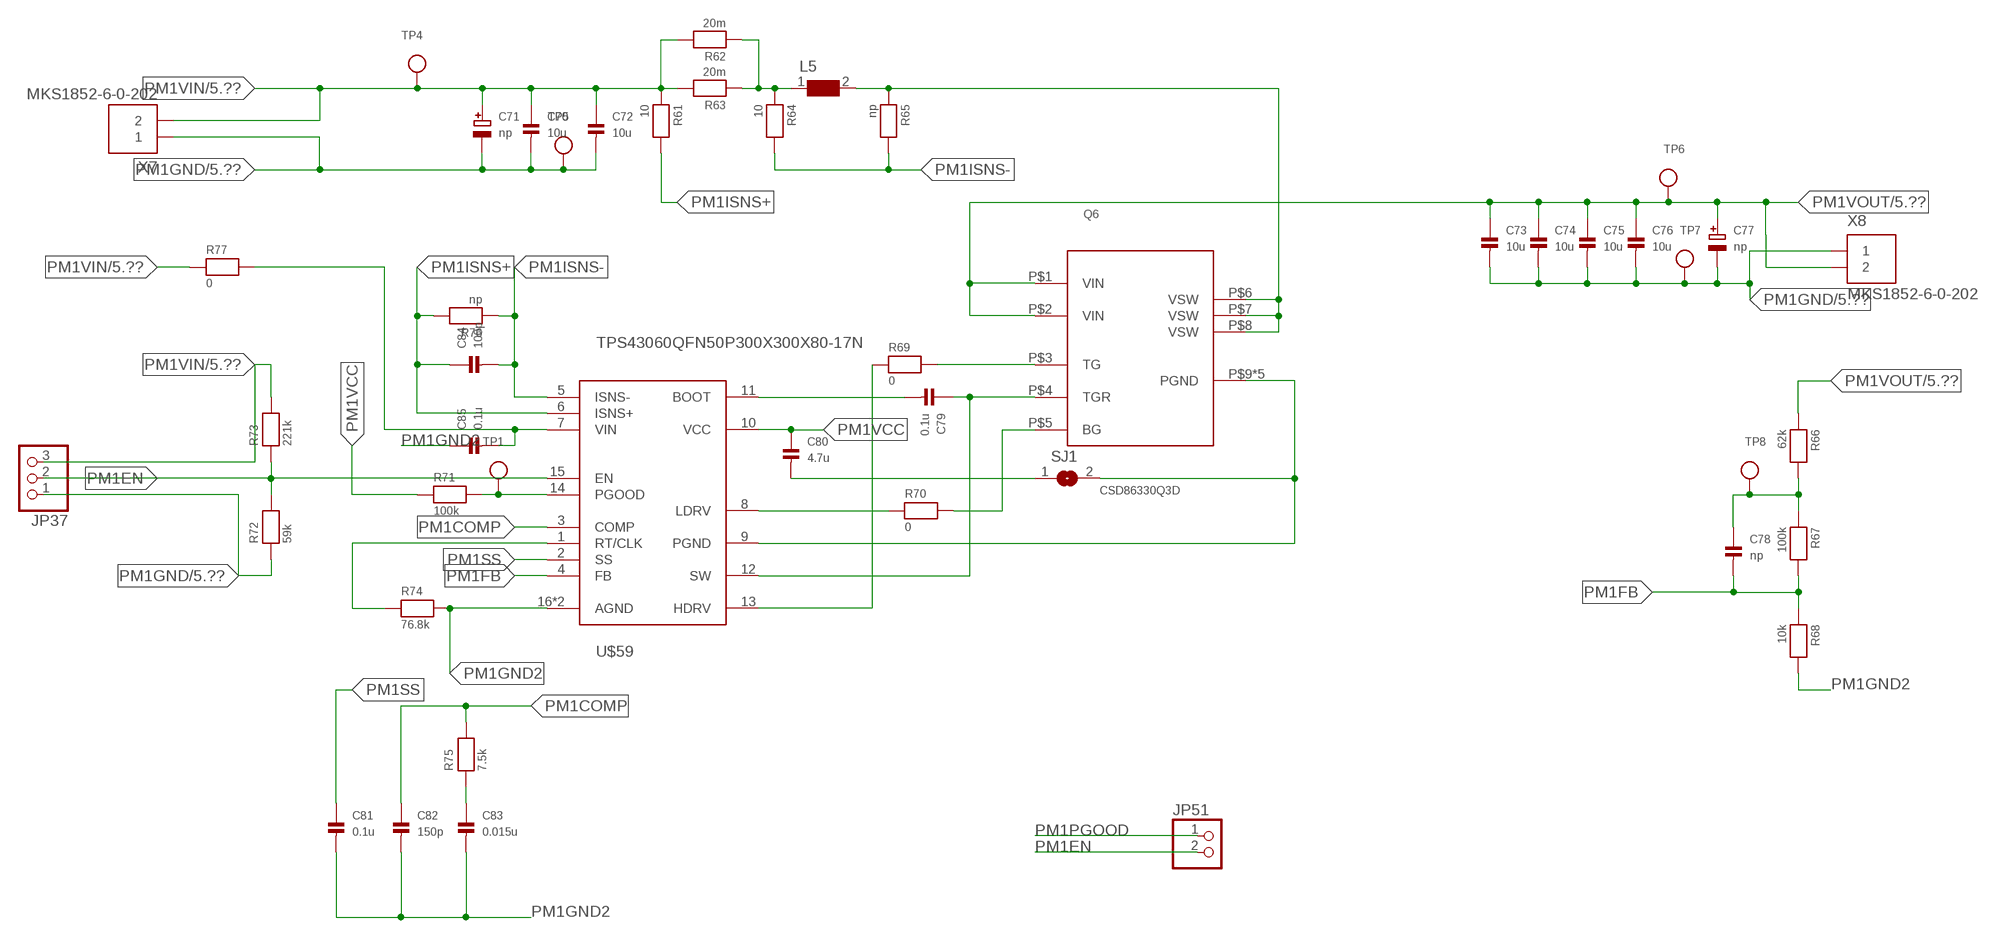
[diagram p6: schematic, sheet 7]

### Parts
C70  10u  CAP_CERAMIC1206  [1206]
C71  np  CAP_ELECTROLYTICPTH_3.5MMGRID_10MMDIA  [CELEC_3.5MM_10MM]
C72  10u  CAP_CERAMIC1206  [1206]
C73  10u  CAP_CERAMIC1206  [1206]
C74  10u  CAP_CERAMIC1206  [1206]
C75  10u  CAP_CERAMIC1206  [1206]
C76  10u  CAP_CERAMIC1206  [1206]
C77  np  CAP_ELECTROLYTICPTH_3.5MMGRID_10MMDIA  [CELEC_3.5MM_10MM]
C78  np  CAP_CERAMIC_0603  [_0603]
C79  0.1u  CAP_CERAMIC_0603  [_0603]
C80  4.7u  CAP_CERAMIC_0603  [_0603]
C81  0.1u  CAP_CERAMIC_0603  [_0603]
C82  150p  CAP_CERAMIC_0603  [_0603]
C83  0.015u  CAP_CERAMIC_0603  [_0603]
C84  100p  CAP_CERAMIC_0603MP  [_0603MP]
C85  0.1u  CAP_CERAMIC_0603MP  [_0603MP]
JP37  HEADER-1X376MIL  [1X03_ROUND_76]
JP51  HEADER-1X2ROUND  [1X02_ROUND]
L5  WE-HCI-744311330_7030/7040/7050  [WE-HCI_7030/7040/7050]
Q6  CSD86330Q3D  [SON330X330]
R61  10  RESISTOR_0603MP  [_0603MP]
R62  20m  RESISTOR1206  [1206]
R63  20m  RESISTOR1206  [1206]
R64  10  RESISTOR_0603MP  [_0603MP]
R65  np  RESISTOR_0603MP  [_0603MP]
R66  62k  RESISTOR0603  [0603]
R67  100k  RESISTOR0603  [0603]
R68  10k  RESISTOR0603  [0603]
R69  0  RESISTOR0603  [0603]
R70  0  RESISTOR0603  [0603]
R71  100k  RESISTOR0603  [0603]
R72  59k  RESISTOR0603  [0603]
R73  221k  RESISTOR0603  [0603]
R74  76.8k  RESISTOR0603  [0603]
R75  7.5k  RESISTOR0603  [0603]
R76  np  RESISTOR_0603MP  [_0603MP]
R77  0  RESISTOR0603  [0603]
SJ1  SOLDERJUMPER  [SOLDERJUMPER_ARROW_NOPASTE]
TP1  TESTPOINT0.1"  [1X01_ROUND]
TP4  TESTPOINT0.1"  [1X01_ROUND]
TP5  TESTPOINT0.1"  [1X01_ROUND]
TP6  TESTPOINT0.1"  [1X01_ROUND]
TP7  TESTPOINT0.1"  [1X01_ROUND]
TP8  TESTPOINT0.1"  [1X01_ROUND]
U$59  TPS43060QFN50P300X300X80-17N  [QFN50P300X300X80-17N]
X7  MKS1852-6-0-202  [MKS1852-6-0-202]
X8  MKS1852-6-0-202  [MKS1852-6-0-202]

### Nets
N$62: L5.1 R62.1 R63.1 R64.1
N$63: L5.2 Q6.P$6(VSW) Q6.P$7(VSW) Q6.P$8(VSW) R65.1
N$67: C78.1 R66.2 R67.1 TP8.1
N$75: Q6.P$3(TG) R69.2
N$77: R69.1 U$59.13(HDRV)
N$78: C79.1 Q6.P$4(TGR) U$59.12(SW)
N$79: C79.2 U$59.11(BOOT)
N$82: R70.1 U$59.8(LDRV)
N$83: Q6.P$5(BG) R70.2
N$87: R74.1 U$59.1(RT/CLK)
N$89: C83.1 R75.1
N$90: C85.2 R77.2 U$59.7(VIN)
PM1COMP: C82.1 R75.2 U$59.3(COMP)
PM1EN: JP37.2 JP51.2 R72.2 R73.1 U$59.15(EN)
PM1FB: C78.2 R67.2 R68.1 U$59.4(FB)
PM1GND: C70.2 C71.- C72.2 C73.2 C74.2 C75.2 C76.2 C77.- JP37.1 Q6.P$9(PGND) Q6.P$10(PGND) Q6.P$11(PGND) Q6.P$12(PGND) Q6.P$13(PGND) R72.1 SJ1.2 TP5.1 TP7.1 U$59.9(PGND) X7.1 X8.1 ; also sheet 5
PM1GND2: C80.2 C81.2 C82.2 C83.2 C85.1 R68.2 R74.2 SJ1.1 U$59.16(AGND) U$59.17(AGND)
PM1ISNS+: C84.1 R61.2 R76.2 U$59.6(ISNS+)
PM1ISNS-: C84.2 R64.2 R65.2 R76.1 U$59.5(ISNS-)
PM1PGOOD: JP51.1 R71.2 TP1.1 U$59.14(PGOOD)
PM1SS: C81.1 U$59.2(SS)
PM1VCC: C80.1 R71.1 U$59.10(VCC)
PM1VIN: C70.1 C71.+ C72.1 JP37.3 R61.1 R62.2 R63.2 R73.2 R77.1 TP4.1 X7.2 ; also sheet 5
PM1VOUT: C73.1 C74.1 C75.1 C76.1 C77.+ Q6.P$1(VIN) Q6.P$2(VIN) R66.1 TP6.1 X8.2 ; also sheet 5

## Sheet 8 of 10: 15V DC/DC Boost Conv
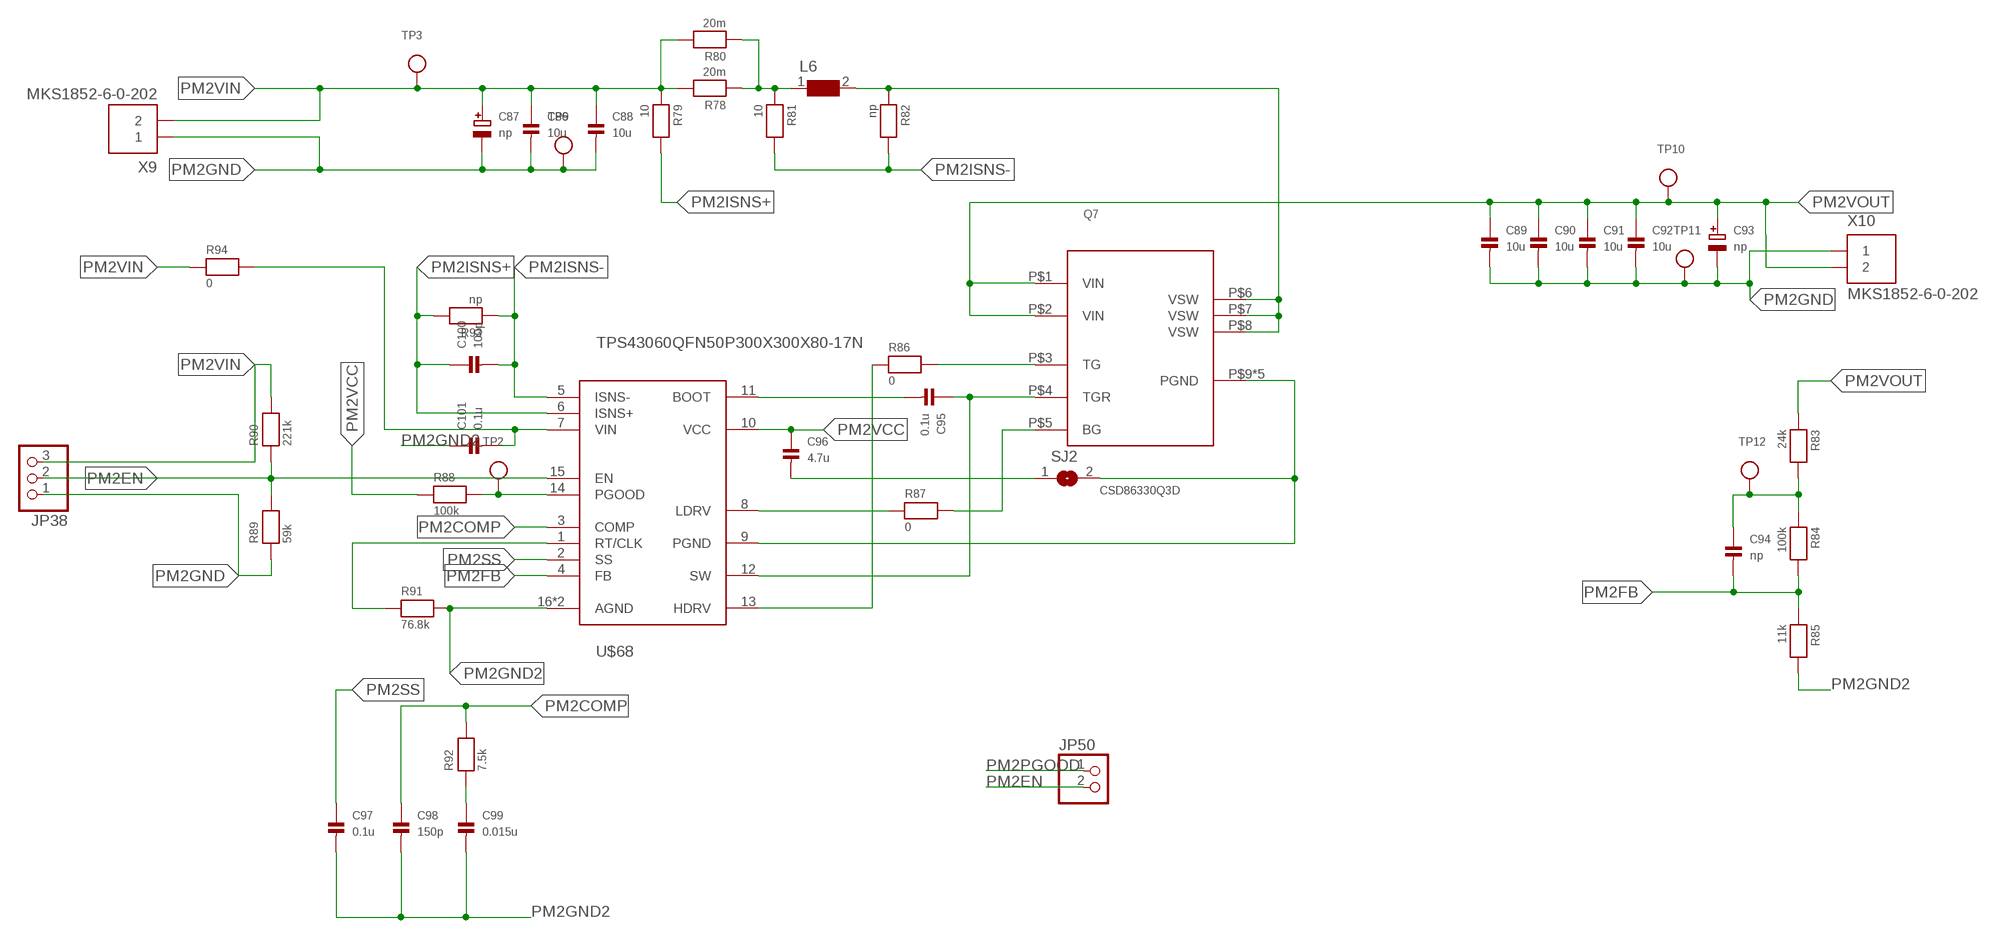
[diagram p7: schematic, sheet 8]

### Parts
C86  10u  CAP_CERAMIC1206  [1206]
C87  np  CAP_ELECTROLYTICPTH_3.5MMGRID_10MMDIA  [CELEC_3.5MM_10MM]
C88  10u  CAP_CERAMIC1206  [1206]
C89  10u  CAP_CERAMIC1206  [1206]
C90  10u  CAP_CERAMIC1206  [1206]
C91  10u  CAP_CERAMIC1206  [1206]
C92  10u  CAP_CERAMIC1206  [1206]
C93  np  CAP_ELECTROLYTICPTH_3.5MMGRID_10MMDIA  [CELEC_3.5MM_10MM]
C94  np  CAP_CERAMIC_0603  [_0603]
C95  0.1u  CAP_CERAMIC_0603  [_0603]
C96  4.7u  CAP_CERAMIC_0603  [_0603]
C97  0.1u  CAP_CERAMIC_0603  [_0603]
C98  150p  CAP_CERAMIC_0603  [_0603]
C99  0.015u  CAP_CERAMIC_0603  [_0603]
C100  100p  CAP_CERAMIC_0603MP  [_0603MP]
C101  0.1u  CAP_CERAMIC_0603MP  [_0603MP]
JP38  HEADER-1X376MIL  [1X03_ROUND_76]
JP50  HEADER-1X2ROUND  [1X02_ROUND]
L6  WE-HCI-744311330_7030/7040/7050  [WE-HCI_7030/7040/7050]
Q7  CSD86330Q3D  [SON330X330]
R78  20m  RESISTOR1206  [1206]
R79  10  RESISTOR_0603MP  [_0603MP]
R80  20m  RESISTOR1206  [1206]
R81  10  RESISTOR_0603MP  [_0603MP]
R82  np  RESISTOR_0603MP  [_0603MP]
R83  24k  RESISTOR0603  [0603]
R84  100k  RESISTOR0603  [0603]
R85  11k  RESISTOR0603  [0603]
R86  0  RESISTOR0603  [0603]
R87  0  RESISTOR0603  [0603]
R88  100k  RESISTOR0603  [0603]
R89  59k  RESISTOR0603  [0603]
R90  221k  RESISTOR0603  [0603]
R91  76.8k  RESISTOR0603  [0603]
R92  7.5k  RESISTOR0603  [0603]
R93  np  RESISTOR_0603MP  [_0603MP]
R94  0  RESISTOR0603  [0603]
SJ2  SOLDERJUMPER  [SOLDERJUMPER_ARROW_NOPASTE]
TP2  TESTPOINT0.1"  [1X01_ROUND]
TP3  TESTPOINT0.1"  [1X01_ROUND]
TP9  TESTPOINT0.1"  [1X01_ROUND]
TP10  TESTPOINT0.1"  [1X01_ROUND]
TP11  TESTPOINT0.1"  [1X01_ROUND]
TP12  TESTPOINT0.1"  [1X01_ROUND]
U$68  TPS43060QFN50P300X300X80-17N  [QFN50P300X300X80-17N]
X9  MKS1852-6-0-202  [MKS1852-6-0-202]
X10  MKS1852-6-0-202  [MKS1852-6-0-202]

### Nets
N$80: L6.1 R78.1 R80.1 R81.1
N$81: L6.2 Q7.P$6(VSW) Q7.P$7(VSW) Q7.P$8(VSW) R82.1
N$85: C94.1 R83.2 R84.1 TP12.1
N$86: Q7.P$3(TG) R86.2
N$88: R86.1 U$68.13(HDRV)
N$91: C95.1 Q7.P$4(TGR) U$68.12(SW)
N$92: C95.2 U$68.11(BOOT)
N$93: R87.1 U$68.8(LDRV)
N$94: Q7.P$5(BG) R87.2
N$96: R91.1 U$68.1(RT/CLK)
N$97: C99.1 R92.1
N$98: C101.2 R94.2 U$68.7(VIN)
PM2COMP: C98.1 R92.2 U$68.3(COMP)
PM2EN: JP38.2 JP50.2 R89.2 R90.1 U$68.15(EN)
PM2FB: C94.2 R84.2 R85.1 U$68.4(FB)
PM2GND: C86.2 C87.- C88.2 C89.2 C90.2 C91.2 C92.2 C93.- JP38.1 Q7.P$9(PGND) Q7.P$10(PGND) Q7.P$11(PGND) Q7.P$12(PGND) Q7.P$13(PGND) R89.1 SJ2.2 TP9.1 TP11.1 U$68.9(PGND) X9.1 X10.1
PM2GND2: C96.2 C97.2 C98.2 C99.2 C101.1 R85.2 R91.2 SJ2.1 U$68.16(AGND) U$68.17(AGND)
PM2ISNS+: C100.1 R79.2 R93.2 U$68.6(ISNS+)
PM2ISNS-: C100.2 R81.2 R82.2 R93.1 U$68.5(ISNS-)
PM2PGOOD: JP50.1 R88.2 TP2.1 U$68.14(PGOOD)
PM2SS: C97.1 U$68.2(SS)
PM2VCC: C96.1 R88.1 U$68.10(VCC)
PM2VIN: C86.1 C87.+ C88.1 JP38.3 R78.2 R79.1 R80.2 R90.2 R94.1 TP3.1 X9.2
PM2VOUT: C89.1 C90.1 C91.1 C92.1 C93.+ Q7.P$1(VIN) Q7.P$2(VIN) R83.1 TP10.1 X10.2

## Sheet 9 of 10: MCU
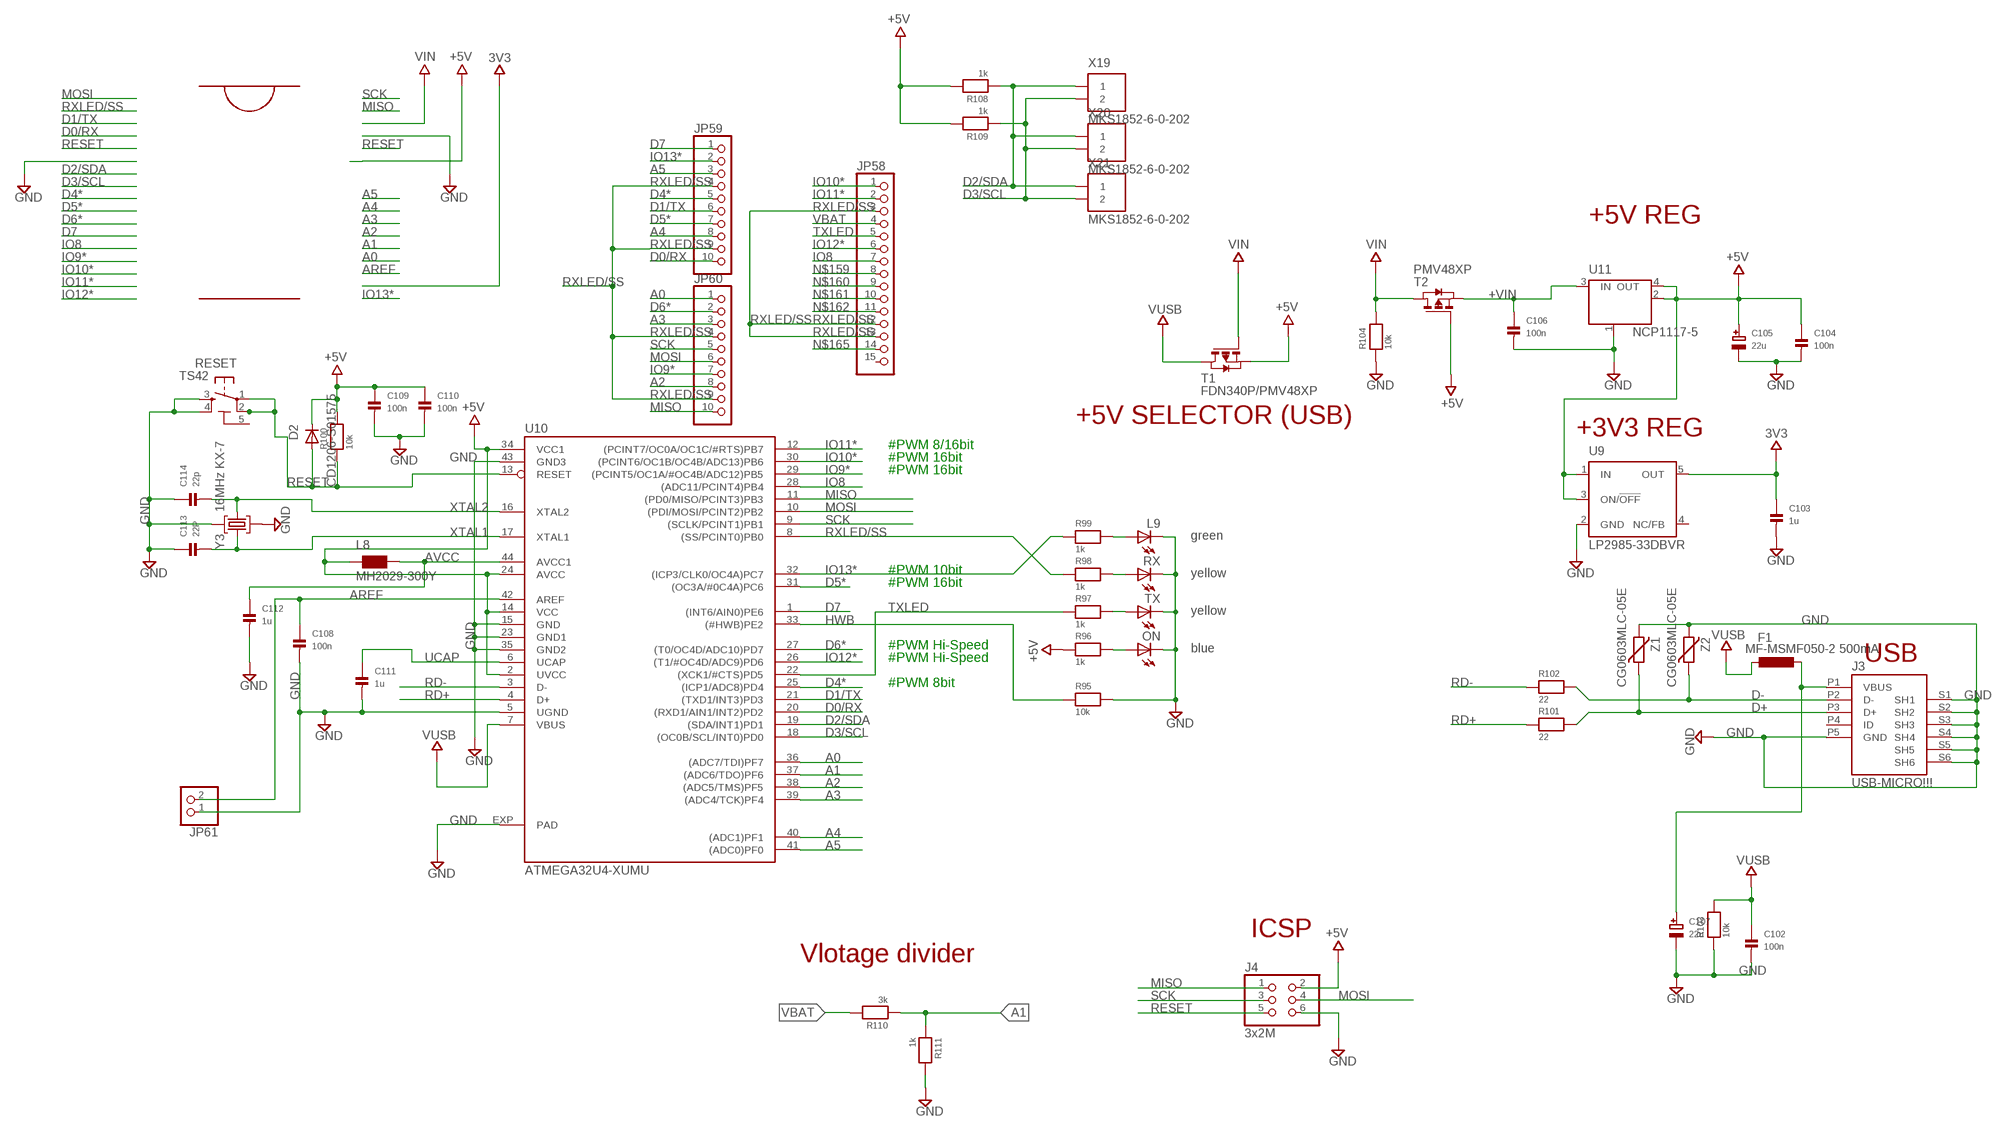
[diagram p8: schematic, sheet 9]

### Parts
C102  100n  CAP_CERAMIC_0603  [_0603]
C103  1u  CAP_CERAMIC_0603  [_0603]
C104  100n  CAP_CERAMIC_0603  [_0603]
C105  22u  CAP_TANTALUMA/3216_REFLOW  [EIA3216-18/A-R]
C106  100n  CAP_CERAMIC_0603  [_0603]
C107  22u  CAP_TANTALUMA/3216_REFLOW  [EIA3216-18/A-R]
C108  100n  CAP_CERAMIC_0603  [_0603]
C109  100n  CAP_CERAMIC_0603  [_0603]
C110  100n  CAP_CERAMIC_0603  [_0603]
C111  1u  CAP_CERAMIC_0603  [_0603]
C112  1u  CAP_CERAMIC_0603  [_0603]
C113  22P  CAP_CERAMIC_0603  [_0603]
C114  22p  CAP_CERAMIC_0603  [_0603]
D2  CD1206-S01575  DIODE-MINIMELF  [MINIMELF]
F1  MF-MSMF050-2 500mA  L-EUL1812  [L1812]
J3  USB-MICRO!!!  MYCON2_USB-MINI-B  [CON2_USB_MICRO_B_AT]
J4  3x2M  PINHD-2X3  [2X03]
JP58  HEADER-1X15  [1X15_ROUND_70]
JP59  HEADER-1X1070MIL  [1X10_ROUND70]
JP60  HEADER-1X1070MIL  [1X10_ROUND70]
JP61  HEADER-1X2ROUND  [1X02_ROUND]
L8  MH2029-300Y  WE-CBF_0805  [0805]
L9  green  LEDCHIPLED_0603  [CHIPLED_0603]
ON  blue  LEDCHIPLED_0603  [CHIPLED_0603]
R95  10k  RESISTOR_0603  [_0603]
R96  1k  RESISTOR_0603  [_0603]
R97  1k  RESISTOR_0603  [_0603]
R98  1k  RESISTOR_0603  [_0603]
R99  1k  RESISTOR_0603  [_0603]
R100  10k  RESISTOR_0603  [_0603]
R101  22  RESISTOR_0603  [_0603]
R102  22  RESISTOR_0603  [_0603]
R103  10k  RESISTOR_0603  [_0603]
R104  10k  RESISTOR_0603  [_0603]
R108  1k  RESISTOR_0603  [_0603]
R109  1k  RESISTOR_0603  [_0603]
R110  3k  RESISTOR_0603MP  [_0603MP]
R111  1k  RESISTOR_0603MP  [_0603MP]
RESET  TS42  [TS42]
RX  yellow  LEDCHIPLED_0603  [CHIPLED_0603]
T1  FDN340P/PMV48XP  PMOSSOT23  [SOT-23]
T2  PMV48XP  PMOSSOT23  [SOT-23]
TX  yellow  LEDCHIPLED_0603  [CHIPLED_0603]
U9  LP2985-33DBVR  LP2985-XXDBVR33  [SOT23-DBV]
U10  ATMEGA32U4-XUMU  [QFN44ML7X7]
U11  NCP1117-5  LINEAR_MC33269ST  [LINEAR_SOT223]
X19  MKS1852-6-0-202  [MKS1852-6-0-202]
X20  MKS1852-6-0-202  [MKS1852-6-0-202]
X21  MKS1852-6-0-202  [MKS1852-6-0-202]
Y3  16MHz KX-7  CRYSTAL-3.2-2.5  [CRYSTAL-3.2-2.5]
Z1  CG0603MLC-05E  VARISTORCN0603  [CT/CN0603]
Z2  CG0603MLC-05E  VARISTORCN0603  [CT/CN0603]

### Nets
3V3: C103.1 U9.5(OUT)
+5V: C104.1 C105.+ C109.1 C110.1 D2.C J4.2 L8.1 R96.1 R100.2 R108.2 R109.2 T1.2(S) T2.3(G) U9.1(IN) U9.3(ON/!OFF) U10.2(UVCC) U10.14(VCC) U10.24(AVCC) U10.34(VCC1) U11.2(OUT) U11.4(OUT)
+VIN: C106.1 T2.2(S) U11.3(IN)
A0: JP60.1 U10.36((ADC7/TDI)PF7)
A1: R110.1 R111.1 U10.37((ADC6/TDO)PF6)
A2: JP60.8 U10.38((ADC5/TMS)PF5)
A3: JP60.3 U10.39((ADC4/TCK)PF4)
A4: JP59.8 U10.40((ADC1)PF1)
A5: JP59.3 U10.41((ADC0)PF0)
AREF: C108.1 JP61.2 U10.42(AREF)
AVCC: C112.1 L8.2 U10.44(AVCC1)
D0/RX: JP59.10 U10.20((RXD1/AIN1/INT2)PD2)
D1/TX: JP59.6 U10.21((TXD1/INT3)PD3)
D2/SDA: R108.1 U10.19((SDA/INT1)PD1) X19.1 X20.1 X21.1
D3/SCL: R109.1 U10.18((OC0B/SCL/INT0)PD0) X19.2 X20.2 X21.2
D4*: JP59.5 U10.25((ICP1/ADC8)PD4)
D5*: JP59.7 U10.31((OC3A/#0C4A)PC6)
D6*: JP60.2 U10.27((T0/OC4D/ADC10)PD7)
D7: JP59.1 U10.1((INT6/AIN0)PE6)
D+: J3.P3(D+) R101.2 Z1.1
D-: J3.P2(D-) R102.2 Z2.1
GND: C102.2 C103.2 C104.2 C105.- C106.2 C107.- C108.2 C109.2 C110.2 C111.2 C112.2 C113.1 C114.1 J3.P5(GND) J3.S1(SH1) J3.S2(SH2) J3.S3(SH3) J3.S4(SH4) J3.S5(SH5) J3.S6(SH6) J4.6 JP61.1 L9.C ON.C R95.2 R103.1 R104.1 R111.2 RESET.3 RESET.4 RX.C TX.C U9.2(GND) U10.5(UGND) U10.15(GND) U10.23(GND1) U10.35(GND2) U10.43(GND3) U10.EXP(PAD) U11.1(GND/ADJ) Y3.2(GND) Y3.4(GND) Z1.2 Z2.2
HWB: R95.1 U10.33((#HWB)PE2)
IO8: JP58.7 U10.28((ADC11/PCINT4)PB4)
IO9*: JP60.7 U10.29((PCINT5/OC1A/#OC4B/ADC12)PB5)
IO10*: JP58.1 U10.30((PCINT6/OC1B/OC4B/ADC13)PB6)
IO11*: JP58.2 U10.12((PCINT7/OC0A/OC1C/#RTS)PB7)
IO12*: JP58.6 U10.26((T1/#OC4D/ADC9)PD6)
IO13*: JP59.2 R99.1 U10.32((ICP3/CLK0/OC4A)PC7)
MISO: J4.1 JP60.10 U10.11((PD0/MISO/PCINT3)PB3)
MOSI: J4.4 JP60.6 U10.10((PDI/MOSI/PCINT2)PB2)
N$118: L9.A R99.2
N$119: R98.2 RX.A
N$120: R97.2 TX.A
N$121: ON.A R96.2
N$159: JP58.8
N$160: JP58.9
N$161: JP58.10
N$162: JP58.11
N$165: JP58.14
RD+: R101.1 U10.4(D+)
RD-: R102.1 U10.3(D-)
RESET: D2.A J4.5 R100.1 RESET.1 RESET.2 U10.13(RESET)
RXLED/SS: JP58.3 JP58.12 JP58.13 JP59.4 JP59.9 JP60.4 JP60.9 R98.1 U10.8((SS/PCINT0)PB0)
SCK: J4.3 JP60.5 U10.9((SCLK/PCINT1)PB1)
TXLED: JP58.5 R97.1 U10.22((XCK1/#CTS)PD5)
UCAP: C111.1 U10.6(UCAP)
VBAT: JP58.4 R110.2
VIN: R104.2 T1.3(G) T2.1(D)
VUSB: C102.1 F1.2 R103.2 T1.1(D) U10.7(VBUS)
VUSBD: C107.+ F1.1 J3.P1(VBUS)
XTAL1: C113.2 U10.17(XTAL1) Y3.3(C2)
XTAL2: C114.2 U10.16(XTAL2) Y3.1(C1)
Unconnected: J3.P4(ID) JP58.15 U9.4(NC/FB)

### Notes on the sheet
- +5V REG
- +5V SELECTOR (USB)
- +3V3 REG
- #PWM 8/16bit
- #PWM 16bit
- #PWM 16bit
- #PWM 10bit
- #PWM 16bit
- #PWM Hi-Speed
- #PWM Hi-Speed | USB
- #PWM 8bit
- ICSP
- Vlotage divider

## Sheet 10 of 10: 5V DC/DC converter
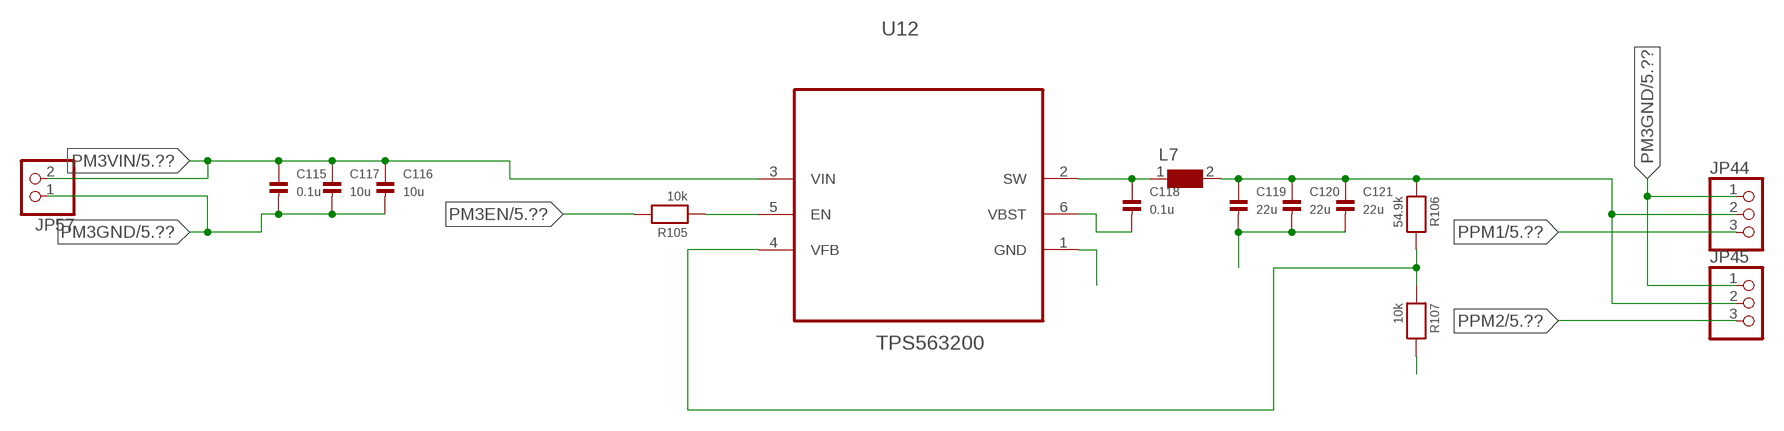
[diagram p9: schematic, sheet 10]

### Parts
C115  0.1u  CAP_CERAMIC_0603  [_0603]
C116  10u  CAP_CERAMIC1206  [1206]
C117  10u  CAP_CERAMIC1206  [1206]
C118  0.1u  CAP_CERAMIC_0603  [_0603]
C119  22u  CAP_CERAMIC1206  [1206]
C120  22u  CAP_CERAMIC1206  [1206]
C121  22u  CAP_CERAMIC1206  [1206]
JP44  HEADER-1X376MIL  [1X03_ROUND_76]
JP45  HEADER-1X376MIL  [1X03_ROUND_76]
JP57  HEADER-1X2ROUND  [1X02_ROUND]
L7  WE-HCI-744311330_7030/7040/7050  [WE-HCI_7030/7040/7050]
R105  10k  RESISTOR_0603  [_0603]
R106  54.9k  RESISTOR_0603  [_0603]
R107  10k  RESISTOR_0603  [_0603]
U12  TPS563200  [SOT95P280X145-6N]

### Nets
N$144: R105.1 U12.5(EN)
N$145: R106.2 R107.1 U12.4(VFB)
N$147: C118.1 L7.1 U12.2(SW)
N$149: C118.2 U12.6(VBST)
PM3EN: R105.2 ; also sheet 5
PM3GND: C115.2 C116.2 C117.2 C119.2 C120.2 C121.2 JP44.1 JP45.1 JP57.1 R107.2 U12.1(GND) ; also sheet 5
PM3VIN: C115.1 C116.1 C117.1 JP57.2 U12.3(VIN) ; also sheet 5
PM3VOUT: C119.1 C120.1 C121.1 JP44.2 JP45.2 L7.2 R106.1
PPM1: JP44.3 ; also sheet 5
PPM2: JP45.3 ; also sheet 5

## Power pins joined to a net without a drawn wire
5-GND: RESET.5(5-GND)

## Library data of the parts
C1 C2 C5 C6 C8-C10 C12 C13 C16 C17 C19-C21 C23 C24 C27 C28 C30-C32 C34 C35 C38 C39 C41-C43 C45 C46 C48-C56 C58-C65 C70 C72-C76 C78-C86 C88-C92 C94-C104 C106 C108-C121 = microbuilder:CAP_CERAMIC: Ceramic Capacitors 0402 - 0402 Surface Mount Capacitors 16pF 50V 5% [Digikey: 445-4899-2-ND] 18pF 50V 5% [Digikey: 490-1281-2-ND] 22pF 50V 5% [Digikey: 490-1283-2-ND] 68pF 50V 5% [Digikey: 490-1289-2-ND] 0.1uF 10V 10% [Digikey: 490-1318-2-ND] 1.0uF 6.3V 10% [Digikey: 490-1320-2-ND] 0603 - 0603 Surface Mount Capacitors 16 pF 50V 5% [Digikey: 445-5051-2-ND] 22 pF 50V [Digikey: PCC220ACVTR-ND] 33 pF 50V 5% [Digikey: 490-1415-1-ND] 56pF 50V 5% [Digikey: 490-1421-1-ND] 220pF 50V 5% [Digikey: 445-1285-1-ND] 680 pF 50V 2200 pF 50V 5% C0G [Digikey: 445-1297-1-ND] 5600 pF 100V 5% X7R [Digikey: 478-3711-1-ND] 0.1 µF 25V 10% [Digikey: PCC2277TR-ND] 0.22 µF 16V 10% X7R [Digikey: 445-1318-1-ND] 1.0 µF 25V 10% [Digikey: 445-5146-2-ND] 0603 - RF Specific 3pF 250V +/-0.1pF RF [Digikey: 712-1347-1-ND] 18 pF 250V 5% [Digikey: 478-3505-1-ND or 712-1322-1-ND] 56 pF 250V 5% C0G RF [Digikey: 490-4867-1-ND] 68 pF 250V RF [Digikey: 490-4868-1-ND] 0805 - 0805 Surface Mount Capacitors 220 pF 250V 2% RF Ceramic Capacitor [Digikey: 712-1398-1-ND] 1000 pF 50V 2% NP0 Ceramic Capacitor [Digikey: 478-3760-1-ND] 0.1 µF 25V 10% Ceramic Capacitor [Digikey: PCC1828TR-ND] 1.0 µF 16V 10% Ceramic Capacitor[Digikey: 490-1691-2-ND] 10.0 µF 10V 10% Ceramic Capacitor[Digikey: 709-1228-1-ND] 10.0 uF 16V 10% Ceramic Capacitor [Digikey: 478-5165-2-ND] 47 uF 6.3V 20% Ceramic Capacitor [Digikey: 587-1779-1-ND or 399-5506-1-ND] 1206 - 1206 Surface Mount Capacitors 47uF 10V 20% Ceramic Capacitor [Digikey: 490-5528-1-ND or 399-5508-1-ND or 445-6010-1-ND] 100uF 6.3V -20%, +80% Y5V Ceramic Capacitor (Digikey: 490-4512-1-ND, Mouser: 81-GRM31CF50J107ZE1L)
C3 C4 C7 C14 C15 C18 C25 C26 C29 C36 C37 C40 C47 C57 C66-C69 C71 C77 C87 C93 = microbuilder:CAP_ELECTROLYTIC: Electrolytic Capacitors SMT PANASONIC_C - Size C Panasonic Electrolytic Aluminum Capacitor 47µF 16V 20% Electrolytic Capacitor [Digikey: PCE3890TR-ND] PANASONIC_D - Size D Panasonic Electrolytic Aluminum Capacitor 100µF 25V 20% Electrolytic Capacitor [Digikey: PCE3898TR-ND] PTH 3.5 mm grid, 8 mm diameter ... 3.5 mm grid, 10 mm diameter ...
C11 C22 C33 C44 = adafruit:C-US: CAPACITOR, American symbol
C105 C107 = microbuilder:CAP_TANTALUM: Tantalum Capacitors Wave footprints have larger pads and are meant to be used for hand soldering. Reflow footprints are optimised for solder paste and a reflow oven. EIA3216-18/A-[R/W] - Size A / 3216-18 / 1206 footprint 4.7µF 25V 10% Tantalum Capacitor 10µF 16V 10% Tantalum Capacitor [Digikey: 495-2236-2-ND] EIA3528-21/B-[R/W] - Size B / 3528-21 47µF 10V 10% Tantalum Capactior [Digikey: 495-2216-1-ND] EIA6032-28/C-[R/W] - Size C / 6032-28 10µF 35V 20% Tantalum Capacitor [Digikey: 495-2285-1-ND] 100µF 16V 10% Tantalum Capactior [Digikey: 399-5214-1-ND]
D2 = diode:DIODE-: DIODE
F1 = rcl:L-EU: INDUCTOR, European symbol
J3 = SmartPrj:MYCON2_USB-MINI-B
J4 = SmartPrj:PINHD-2X3: PIN HEADER
JP1 JP9 JP15 JP17 JP20 JP21 JP23 JP25 JP27 JP28 JP35 JP36 JP41 JP42 = microbuilder:JUMPER2: JUMPER - 2 Pins
JP2 JP10 JP18 JP26 JP29 JP31 JP33 JP34 = microbuilder:HEADER-1X1: PIN HEADER
JP3-JP5 JP7 JP39 JP43 JP59 JP60 = microbuilder:HEADER-1X10: PIN HEADER
JP6 JP11-JP14 JP19 JP22 JP30 JP47 = microbuilder:HEADER-1X7: PIN HEADER
JP8 JP16 JP24 JP32 = microbuilder:JUMPER3: JUMPER - 3 Pins
JP37 JP38 JP40 JP44 JP45 JP48 JP56 = microbuilder:HEADER-1X3: PIN HEADER
JP46 JP49 = microbuilder:HEADER-1X4: PIN HEADER
JP50-JP55 JP57 JP61 = microbuilder:HEADER-1X2: PIN HEADER
JP58 = microbuilder:HEADER-1X15: 1x15 Header
L1-L4 = WE-PD:WE-PD: SMD-Shielded Power Inductors WE-PD - Magnetically shielded version which results in a low leakage field - High storage capacity - Low self-losses - Highest possible current loading for SMD-Inducors -- Switching regulators with low operating voltages (computer, laptop, mobile phones, pagers) -- Integrated DC/DC-converter -- Is recommended for the application with switching regulators from National Semiconductor, Linear Technology, Texas Instruments and Fairchild Semiconductor, ect. -- Graphic cards -- Plastic base: Because of the one piece construction these are more suitable for high vibration or shock applications; MPN: 7447709100; OC_FARNELL: 1635942; OC_NEWARK: 08P2769; PACKAGE: 1210; SUPPLIER: Wuerth Elektronik
L5-L7 = WE-HCI:WE-HCI: SMD-Flat Wire High Current Inductor WE-HCI - Flat wire coil for lower losses at high frequency ranges - Low leakage field - Extremely low profile design - Current loading up to 40 A - Magnetically shielded -- Graphic cards -- Laptops -- Motherboards -- High current switching regulators -- Polyphase-switching regulators -- industrial computers; MPN: 744311330; OC_FARNELL: 1636193; OC_NEWARK: 08P2568; PACKAGE: 7040; SUPPLIER: Würth Elektronik eiSos GmbH
L8 = wuerth-elektronik:WE-CBF: SMD EMI Suppression Ferrite Beads - excellent anti-EMI properties - low DCR - impedances till 3000 ohms - rated current up to 6 A
L9 ON RX TX = led:LED: LED
LED1-LED12 = microbuilder:LED: LED
M1OUTA M1OUTA1-M1OUTA25 M1OUTB M1OUTB1-M1OUTB5 U$81-U$84 U$89 U$90 = microbuilder:MOUNTINGHOLE: Mounting Hole For #2 screws (0.086"/2.18mm width, 0.094"/2.4mm hole) use 2.5mm
Q1-Q4 = transistor-fet:IPB80N03S4L-03
Q5 = microbuilder:TRANSISTOR_NPN: NPN Transistor Transistor (NPN) 500mA 45V - BC817 [Digikey: 568-1631-1-ND] Transistor (NPN) 500mA 45V - BC817,215 [Mouser: 771-BC817-T/R] SOT23-R - SOT23 footprint optimised for use with solder paste and reflow ovens. SOT23-W - SOT23 footprint optimised for hand-soldering (larger pads).
Q6 Q7 = Texas Instruments_By_element14_Batch_1:CSD86330Q3D
R1-R111 = microbuilder:RESISTOR: Resistors 0402 - 0402 Surface Mount Package 22 Ohm 1% 1/16W [Digikey: 311-22.0LRTR-ND] 33 Ohm 5% 1/16W 1.0K 5% 1/16W 1.5K 5% 1/16W 2.0K 1% 1/16W 10.0K 1% 1/16W [Digikey: 311-10.0KLRTR-ND] 10.0K 5% 1/16W [Digikey: RMCF0402JT10K0TR-ND] 12.1K 1% 1/16W [Digikey: 311-22.0LRTR-ND] 100.0K 5% 1/16W 0603 - 0603 Surface Mount Package 0 Ohm 1/10 Watt 1% Resistor 15 Ohm 1/10 Watt 1% Resistor 33 Ohm 1/10 Watt 1% Resistor 49.9 Ohm 1/10 Watt 1% Resistor 100 Ohm 1/10 Watt 1% Resistor 150 Ohm 1/10 Watt 1% Resistor 240 Ohm 1/10 Watt 1% Resistor 390 Ohm 1/10 Watt 1% Resistor 560 Ohm 1/10 Watt 1% Resistor 680 Ohm 1/10 Watt 1% Resistor 750 Ohm 1/10 Watt 1% Resistor 1.0K Ohm 1/10 Watt 1% Resistor 1.5K Ohm 1/10 Watt 1% Resistor 2.0K Ohm 1/10 Watt 1% Resistor 2.2K Ohm 1/10 Watt 1% Resistor 3.3K Ohm 1/10 Watt 1% Resistor 4.7K Ohm 1/10 Watt 1% Resistor 10.0K Ohm 1/10 Watt 1% Resistor 12.0K Ohm 1/10 Watt 1% Resistor 12.1K Ohm 1/10 Watt 1% Resistor 20.0K Ohm 1/10 Watt 1% Resistor 33.0K Ohm 1/10 Watt 1% Resistor 100.0K Ohm 1/10 Watt 1% Resistor 0805 - 0805 Surface Mount Package 0 Ohm 1/8 Watt 1% Resistor 33 Ohm 1/8 Watt 1% Resistor 100 Ohm 1/8 Watt 1% Resistor 150 Ohm 1/8 Watt 1% Resistor 200 Ohm 1/8 Watt 1% Resistor 240 Ohm 1/8 Watt 1% Resistor 330 Ohm 1/8 Watt 1% Resistor 390 Ohm 1/8 Watt 1% Resistor 470 Ohm 1/8 Watt 1% Resistor 1.0K Ohm 1/8 Watt 1% Resistor 1.5K Ohm 1/8 Watt 1% Resistor 2.0K Ohm 1/8 Watt 1% Resistor 4.7K Ohm 1/8 Watt 1% Resistor 5.1K Ohm 1/8 Watt 1% Resistor 5.6K Ohm 1/8 Watt 1% Resistor 10.0K Ohm 1/8 Watt 1% Resistor 22.0K Ohm 1/8 Watt 1% Resistor 33.0K Ohm 1/8 Watt 1% Resistor 100K Ohm 1/8 Watt 1% Resistor 1206 - 1206 Surface Mount Package 2012 - 2010 Surface Mount Package 0.11 Ohm 1/2 Watt 1% Resistor - Digikey: RHM.11UCT-ND
RESET = SmartPrj:TS42: TS42 Dongnan Electronics Tact switch VDC 12V - 50mA
SJ1-SJ8 SJ27-SJ44 = microbuilder:SOLDERJUMPER: SMD Solder JUMPER Solder the two pads together to create a connection, or remove the solder to break it. REFLOW - Use this footprint for solder paste and reflow ovens. WAVE - Use this footprint for hand-soldering (larger pads). CLOSED - Has a trace between the two pads to ensure it is closed by default. The trace needs to be cut to disable the jumper, and can be closed again by creating a solder bridge between the two pads.; BOM: EXCLUDE
SW1 SW2 = microbuilder:SWITCH_PUSHBUTTON: Buttons SOFTTOUCHSMD_SJ - Soft touch temporary push button (Super Junk Akihabara) Compatible with SKPMANE010 [Mouser: 688-SKPMAN]
T1 T2 = zetex:PMOSSOT23: MOS FET; OC_FARNELL: unknown; OC_NEWARK: unknown
TP1-TP12 = microbuilder:TESTPOINT: Test Point Various test points for characterisation and PCB testing TESTPOINT_SMT - Compact Surface Mount Test Point [Digikey: 5016KTR-ND]; BOM: EXCLUDE
U1 U3 U5 U7 = st-microelectronics:VNH5019A-E
U2 U4 U6 U8 = microbuilder:ACS714
U9 = SmartPrj:LP2985-XXDBVR: ULTRALOW-POWER 50-mA LOW-DROPOUT LINEAR REGULATORS 50-mA Low-Dropout Regulator Source: http://focus.ti.com/lit/ds/symlink/tps77001.pdf
U10 = SmartPrj:ATMEGA32U4-XU
U11 = SmartPrj:LINEAR_MC33269ST*: Adjustable Output Low Dropout Voltage Regulator 800 mA Source: http://www.onsemi.com/pub/Collateral/MC33269-D.PDF
U12 = Texas Instruments_By_element14_Batch_1:TPS563200
U$6 = Texas Instruments_By_element14_Batch_1:TPA3116D2
U$59 U$68 = Texas Instruments_By_element14_Batch_1:TPS43060
VR1 = microbuilder:TRIMPOT: Potentiometers 3mm 10K Single Turn - Digikey: 3303W-103ETR-ND 3mm 100K Single Turn - Digikey: 3303X-104ETR-ND
X1 X2 X5-X24 = con-stocko:MKS1852-6-0-202: Serie MKS 1850 Lötstifte In-line, Raster 2.5 mm, Stiftwannen, stehend, mit Rastlasche Source: http://www.stocko.de/de/index.php?seite=ka_rfk2_mks1850.html&rubrik=Katalog+-+RFK+2 rfk_1850.pdf; OC_FARNELL: unknown; OC_NEWARK: unknown
X3 X4 = con-lumberg:RC-5231: RCA connectors according to JEITA RC-5231 RCA-Steckverbinder nach JEITA RC-5231 Source: RCA- Stecker 2poolig.pdf
Y3 = SmartPrj:CRYSTAL-3.2-2.5
Z1 Z2 = varistor:VARISTOR: VARISTOR